# Altium project nuc977.PrjPcb
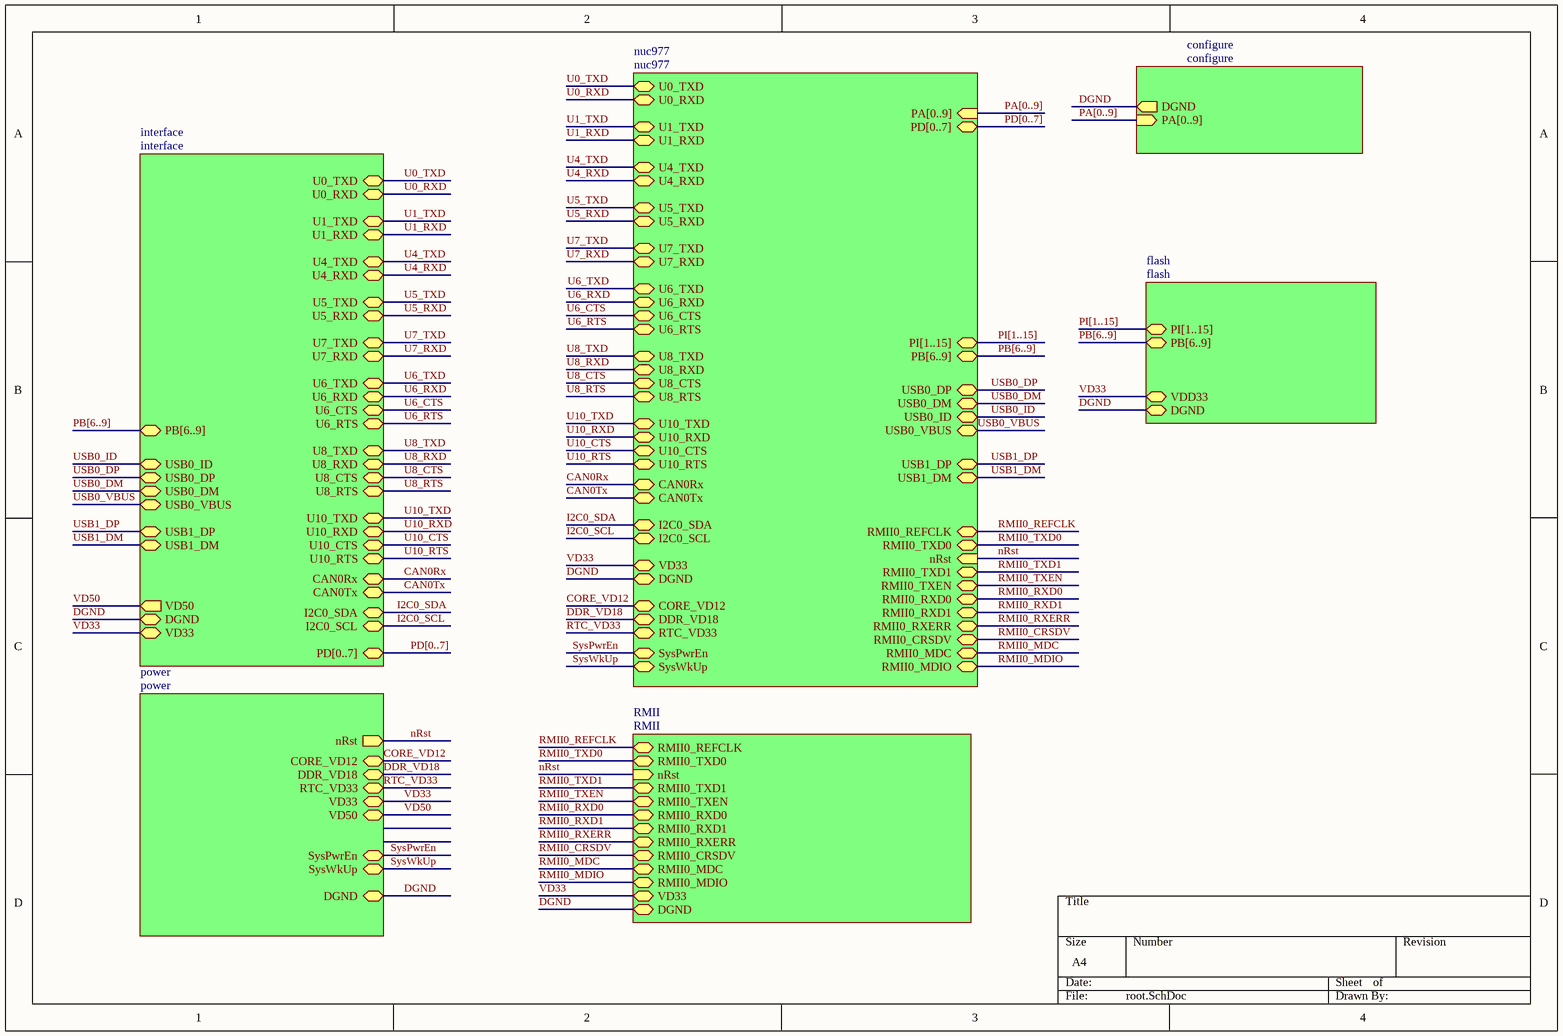
[diagram p0: root.SchDoc]
7 sheets, 234 parts. Net scope: hierarchical (ports join the sheet entries above them; power ports are global).
Board file: simple.PcbDoc
Sheets:
  root.SchDoc
    nuc977 = nuc977.SchDoc
    power = power.SchDoc
    flash = flash.SchDoc
    interface = interface.SchDoc
    configure = configure.SchDoc
    RMII = RMII.SchDoc

## Sheet root.SchDoc
size A4

### Sub-sheets
configure = configure: PA[0..9] (in), DGND (out)
flash = flash: DGND, VDD33, PI[1..15], PB[6..9]
interface = interface: U0_RXD, U0_TXD, U1_TXD, U1_RXD, U4_RXD, U4_TXD, U5_TXD, U5_RXD, U7_TXD, U7_RXD, U6_TXD, U6_RXD, U6_CTS, U6_RTS, U8_TXD, U8_RXD, U8_CTS, U8_RTS, U10_TXD, U10_RXD, U10_CTS, U10_RTS, CAN0Rx, CAN0Tx, I2C0_SDA, I2C0_SCL, DGND, VD33, USB0_DP, USB0_DM, USB0_ID, USB1_DP, USB1_DM, USB0_VBUS, VD50 (out), PD[0..7], PB[6..9]
nuc977 = nuc977: CORE_VD12, RTC_VD33, DDR_VD18, SysPwrEn (bidir), SysWkUp (bidir), VD33, DGND, U0_RXD, U0_TXD, U1_TXD, U1_RXD, U4_RXD, U4_TXD, U5_TXD, U5_RXD, U7_TXD, U7_RXD, U6_TXD, U6_RXD, U6_CTS, U6_RTS, U8_TXD, U8_RXD, U8_CTS, U8_RTS, U10_TXD, U10_RXD, U10_CTS, U10_RTS, CAN0Rx, CAN0Tx, I2C0_SDA, I2C0_SCL, USB0_DP, USB0_DM, PI[1..15], PB[6..9], RMII0_REFCLK, RMII0_TXD0, nRst (in), RMII0_TXD1, RMII0_TXEN, RMII0_RXD0, RMII0_RXD1, RMII0_RXERR, RMII0_CRSDV, RMII0_MDC, RMII0_MDIO, PA[0..9] (in), PD[0..7], USB0_ID, USB1_DP, USB1_DM, USB0_VBUS
power = power: CORE_VD12, RTC_VD33, DDR_VD18, SysPwrEn (bidir), SysWkUp (bidir), VD33, DGND, VD50, nRst (out)
RMII = RMII: RMII0_REFCLK, RMII0_TXD0, nRst (in), RMII0_TXD1, RMII0_TXEN, RMII0_RXD0, RMII0_RXD1, RMII0_RXERR, RMII0_CRSDV, RMII0_MDC, RMII0_MDIO, VD33, DGND

### Nets
CORE_VD12: sheet nuc977/CORE_VD12, sheet power/CORE_VD12
DDR_VD18: sheet nuc977/DDR_VD18, sheet power/DDR_VD18
DGND: sheet nuc977/DGND, sheet power/DGND, sheet flash/DGND, sheet interface/DGND, sheet configure/DGND, sheet RMII/DGND
RTC_VD33: sheet nuc977/RTC_VD33, sheet power/RTC_VD33
VD33: sheet nuc977/VD33, sheet power/VD33, sheet flash/VDD33, sheet interface/VD33, sheet RMII/VD33  [project net IO_VD33]
VD50: sheet power/VD50, sheet interface/VD50
CAN0Rx: sheet nuc977/CAN0Rx, sheet interface/CAN0Rx
CAN0Tx: sheet nuc977/CAN0Tx, sheet interface/CAN0Tx
I2C0_SCL: sheet nuc977/I2C0_SCL, sheet interface/I2C0_SCL
I2C0_SDA: sheet nuc977/I2C0_SDA, sheet interface/I2C0_SDA
nRst: sheet nuc977/nRst, sheet power/nRst, sheet RMII/nRst
RMII0_CRSDV: sheet nuc977/RMII0_CRSDV, sheet RMII/RMII0_CRSDV  [project net CRS_DV]
RMII0_MDC: sheet nuc977/RMII0_MDC, sheet RMII/RMII0_MDC  [project net PF0]
RMII0_MDIO: sheet nuc977/RMII0_MDIO, sheet RMII/RMII0_MDIO  [project net PF1]
RMII0_REFCLK: sheet nuc977/RMII0_REFCLK, sheet RMII/RMII0_REFCLK  [project net PF5]
RMII0_RXD0: sheet nuc977/RMII0_RXD0, sheet RMII/RMII0_RXD0  [project net PF6]
RMII0_RXD1: sheet nuc977/RMII0_RXD1, sheet RMII/RMII0_RXD1  [project net PF7]
RMII0_RXERR: sheet nuc977/RMII0_RXERR, sheet RMII/RMII0_RXERR  [project net FXEN]
RMII0_TXD0: sheet nuc977/RMII0_TXD0, sheet RMII/RMII0_TXD0  [project net PF2]
RMII0_TXD1: sheet nuc977/RMII0_TXD1, sheet RMII/RMII0_TXD1  [project net PF3]
RMII0_TXEN: sheet nuc977/RMII0_TXEN, sheet RMII/RMII0_TXEN  [project net PF4]
SysPwrEn: sheet nuc977/SysPwrEn, sheet power/SysPwrEn
SysWkUp: sheet nuc977/SysWkUp, sheet power/SysWkUp
U0_RXD: sheet nuc977/U0_RXD, sheet interface/U0_RXD  [project net PE1]
U0_TXD: sheet nuc977/U0_TXD, sheet interface/U0_TXD  [project net PE0]
U1_RXD: sheet nuc977/U1_RXD, sheet interface/U1_RXD
U1_TXD: sheet nuc977/U1_TXD, sheet interface/U1_TXD
U4_RXD: sheet nuc977/U4_RXD, sheet interface/U4_RXD
U4_TXD: sheet nuc977/U4_TXD, sheet interface/U4_TXD
U5_RXD: sheet nuc977/U5_RXD, sheet interface/U5_RXD  [project net PB1]
U5_TXD: sheet nuc977/U5_TXD, sheet interface/U5_TXD  [project net PB0]
U6_CTS: sheet nuc977/U6_CTS, sheet interface/U6_CTS  [project net PB5]
U6_RTS: sheet nuc977/U6_RTS, sheet interface/U6_RTS  [project net PB4]
U6_RXD: sheet nuc977/U6_RXD, sheet interface/U6_RXD  [project net PB3]
U6_TXD: sheet nuc977/U6_TXD, sheet interface/U6_TXD  [project net PB2]
U7_RXD: sheet nuc977/U7_RXD, sheet interface/U7_RXD
U7_TXD: sheet nuc977/U7_TXD, sheet interface/U7_TXD
U8_CTS: sheet nuc977/U8_CTS, sheet interface/U8_CTS
U8_RTS: sheet nuc977/U8_RTS, sheet interface/U8_RTS
U8_RXD: sheet nuc977/U8_RXD, sheet interface/U8_RXD
U8_TXD: sheet nuc977/U8_TXD, sheet interface/U8_TXD
U10_CTS: sheet nuc977/U10_CTS, sheet interface/U10_CTS  [project net PB15]
U10_RTS: sheet nuc977/U10_RTS, sheet interface/U10_RTS  [project net PB14]
U10_RXD: sheet nuc977/U10_RXD, sheet interface/U10_RXD  [project net PB13]
U10_TXD: sheet nuc977/U10_TXD, sheet interface/U10_TXD  [project net PB12]
USB0_DM: sheet nuc977/USB0_DM, sheet interface/USB0_DM
USB0_DP: sheet nuc977/USB0_DP, sheet interface/USB0_DP
USB0_ID: sheet nuc977/USB0_ID, sheet interface/USB0_ID
USB0_VBUS: sheet nuc977/USB0_VBUS, sheet interface/USB0_VBUS  [project net PH0]
USB1_DM: sheet nuc977/USB1_DM, sheet interface/USB1_DM
USB1_DP: sheet nuc977/USB1_DP, sheet interface/USB1_DP

### Buses and harness runs
bus PA[0..9] = sheet configure/PA[0..9]
bus PA[0..9] = sheet nuc977/PA[0..9]
bus PB[6..9] = sheet flash/PB[6..9]
bus PB[6..9] = sheet interface/PB[6..9]
bus PB[6..9] = sheet nuc977/PB[6..9]
bus PD[0..7] = sheet interface/PD[0..7]
bus PD[0..7] = sheet nuc977/PD[0..7]
bus PI[1..15] = sheet flash/PI[1..15]
bus PI[1..15] = sheet nuc977/PI[1..15]

## Sheet nuc977.SchDoc
size A3
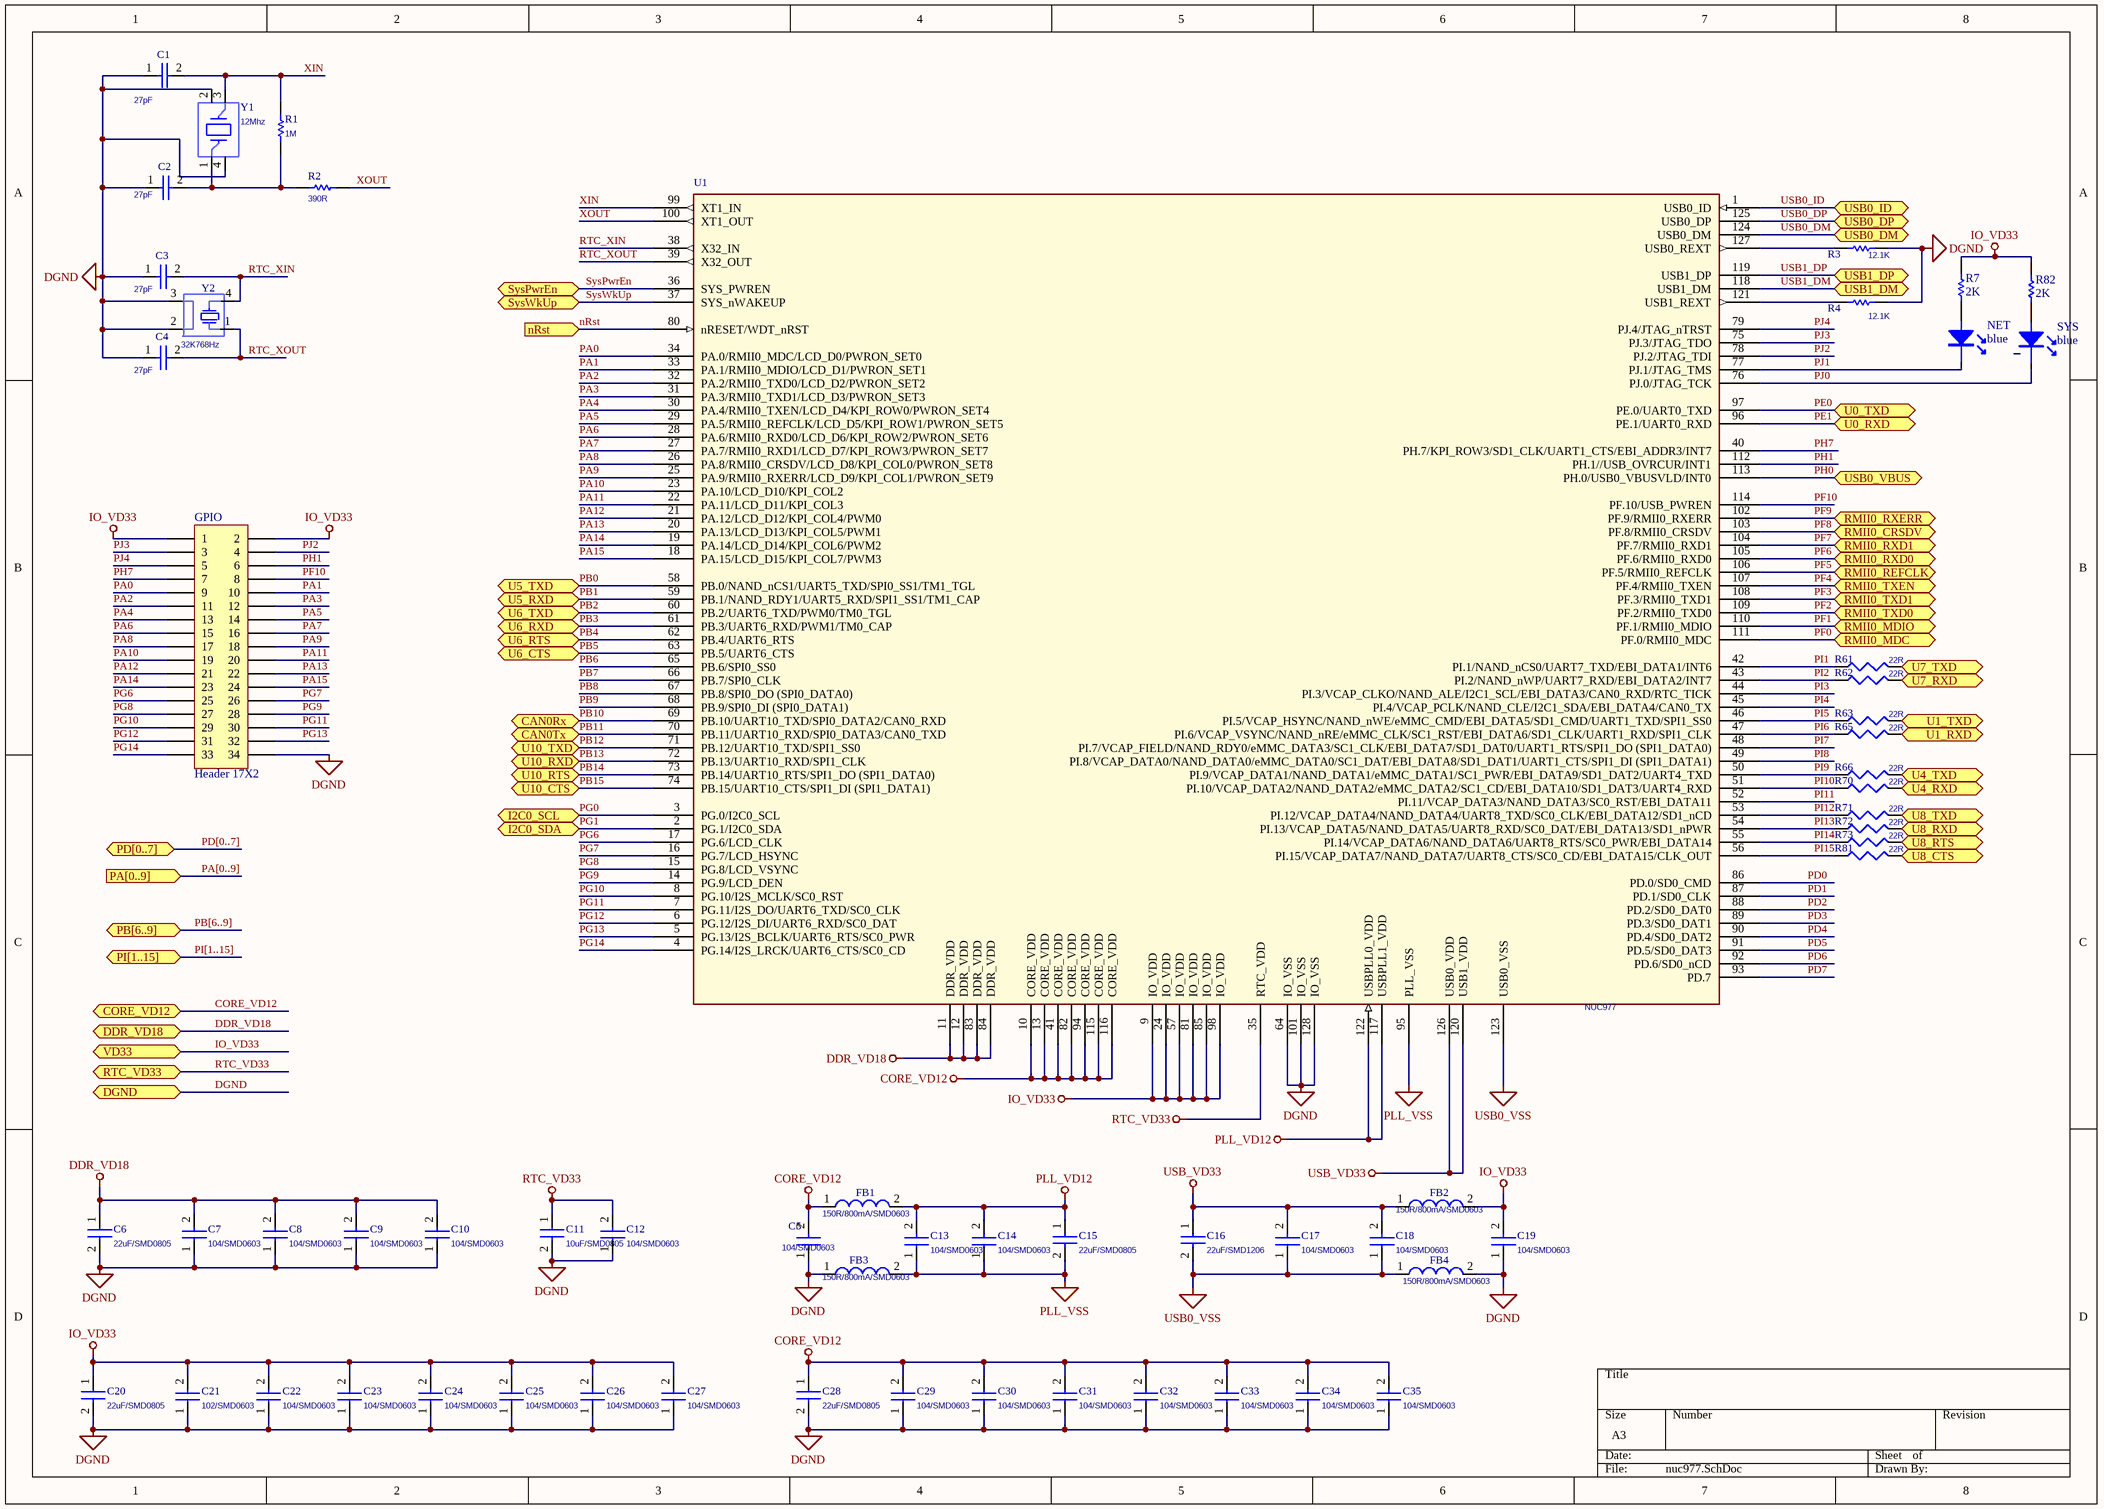
[diagram p1: nuc977.SchDoc]

### Parts
C1  27pF  [0603C]
C2  27pF  [0603C]
C3  27pF  [0603C]
C4  27pF  [0603C]
C5  104/SMD0603  [0603C]
C6  22uF/SMD0805  [C0805]
C7  104/SMD0603  [0603C]
C8  104/SMD0603  [0603C]
C9  104/SMD0603  [0603C]
C10  104/SMD0603  [0603C]
C11  10uF/SMD0805  [C0805]
C12  104/SMD0603  [0603C]
C13  104/SMD0603  [0603C]
C14  104/SMD0603  [0603C]
C15  22uF/SMD0805  [C0805]
C16  22uF/SMD1206  [C0805]
C17  104/SMD0603  [0603C]
C18  104/SMD0603  [0603C]
C19  104/SMD0603  [0603C]
C20  22uF/SMD0805  [C0805]
C21  102/SMD0603  [0603C]
C22  104/SMD0603  [0603C]
C23  104/SMD0603  [0603C]
C24  104/SMD0603  [0603C]
C25  104/SMD0603  [0603C]
C26  104/SMD0603  [0603C]
C27  104/SMD0603  [0603C]
C28  22uF/SMD0805  [C0805]
C29  104/SMD0603  [0603C]
C30  104/SMD0603  [0603C]
C31  104/SMD0603  [0603C]
C32  104/SMD0603  [0603C]
C33  104/SMD0603  [0603C]
C34  104/SMD0603  [0603C]
C35  104/SMD0603  [0603C]
FB1  150R/800mA/SMD0603  [0603R]
FB2  150R/800mA/SMD0603  [0603R]
FB3  150R/800mA/SMD0603  [0603R]
FB4  150R/800mA/SMD0603  [0603R]
GPIO  Header 17X2  [HDR2X17]
NET  blue  [LED-0603]
R1  1M  [0603R]
R2  390R  [0603R]
R3  12.1K  [0603R]
R4  12.1K  [0603R]
R7  2K  [0603C]
R61  22R  [0603R]
R62  22R  [0603R]
R63  22R  [0603R]
R65  22R  [0603R]
R66  22R  [0603R]
R70  22R  [0603R]
R71  22R  [0603R]
R72  22R  [0603R]
R73  22R  [0603R]
R81  22R  [0603R]
R82  2K  [0603C]
SYS  blue  [LED-0603]
U1  NUC977  [QFP128/16/0.4]
Y1  12Mhz  [HCX-3SB3225]
Y2  32K768Hz  [32K768Hz]

### Ports
CAN0Rx, CAN0Tx, CORE_VD12, DDR_VD18, DGND, I2C0_SCL, I2C0_SDA, nRst (in), PA[0..9] (in), PB[6..9], PD[0..7], PI[1..15], RMII0_CRSDV, RMII0_MDC, RMII0_MDIO, RMII0_REFCLK, RMII0_RXD0, RMII0_RXD1, RMII0_RXERR, RMII0_TXD0, RMII0_TXD1, RMII0_TXEN, RTC_VD33, SysPwrEn (bidir), SysWkUp (bidir), U0_RXD, U0_TXD, U1_RXD, U1_TXD, U4_RXD, U4_TXD, U5_RXD, U5_TXD, U6_CTS, U6_RTS, U6_RXD, U6_TXD, U7_RXD, U7_TXD, U8_CTS, U8_RTS, U8_RXD, U8_TXD, U10_CTS, U10_RTS, U10_RXD, U10_TXD, USB0_DM, USB0_DP, USB0_ID, USB0_VBUS, USB1_DM, USB1_DP, VD33

### Nets
CORE_VD12: C5.2 C28.1 C29.2 C30.2 C31.2 C32.2 C33.2 C34.2 C35.2 FB1.1 U1.10(CORE_VDD) U1.13(CORE_VDD) U1.41(CORE_VDD) U1.82(CORE_VDD) U1.94(CORE_VDD) U1.115(CORE_VDD) U1.116(CORE_VDD) ; port CORE_VD12
DDR_VD18: C6.1 C7.2 C8.2 C9.2 C10.2 U1.11(DDR_VDD) U1.12(DDR_VDD) U1.83(DDR_VDD) U1.84(DDR_VDD) ; port DDR_VD18
DGND: C1.1 C2.1 C3.1 C4.1 C5.1 C6.2 C7.1 C8.1 C9.1 C10.1 C11.2 C12.1 C19.1 C20.2 C21.1 C22.1 C23.1 C24.1 C25.1 C26.1 C27.1 C28.2 C29.1 C30.1 C31.1 C32.1 C33.1 C34.1 C35.1 FB3.1 FB4.2 GPIO.34 R3.2 R4.2 U1.64(IO_VSS) U1.101(IO_VSS) U1.128(IO_VSS) Y1.2 Y1.4 Y2.2 Y2.3 ; port DGND
IO_VD33: C19.2 C20.1 C21.2 C22.2 C23.2 C24.2 C25.2 C26.2 C27.2 FB2.2 GPIO.1 GPIO.2 R7.2 R82.2 U1.9(IO_VDD) U1.24(IO_VDD) U1.57(IO_VDD) U1.81(IO_VDD) U1.85(IO_VDD) U1.98(IO_VDD) ; port VD33
PLL_VD12: C13.2 C14.2 C15.1 FB1.2 U1.117(USBPLL1_VDD) U1.122(USBPLL0_VDD)
PLL_VSS: C13.1 C14.1 C15.2 FB3.2 U1.95(PLL_VSS)
RTC_VD33: C11.1 C12.2 U1.35(RTC_VDD) ; port RTC_VD33
USB0_VSS: C16.2 C17.1 C18.1 FB4.1 U1.123(USB0_VSS)
USB_VD33: C16.1 C17.2 C18.2 FB2.1 U1.120(USB1_VDD) U1.126(USB0_VDD)
nRst: U1.80(nRESET/WDT_nRST) ; port nRst
PA0: GPIO.9 U1.34(PA.0/RMII0_MDC/LCD_D0/PWRON_SET0)
PA1: GPIO.10 U1.33(PA.1/RMII0_MDIO/LCD_D1/PWRON_SET1)
PA2: GPIO.11 U1.32(PA.2/RMII0_TXD0/LCD_D2/PWRON_SET2)
PA3: GPIO.12 U1.31(PA.3/RMII0_TXD1/LCD_D3/PWRON_SET3)
PA4: GPIO.13 U1.30(PA.4/RMII0_TXEN/LCD_D4/KPI_ROW0/PWRON_SET4)
PA5: GPIO.14 U1.29(PA.5/RMII0_REFCLK/LCD_D5/KPI_ROW1/PWRON_SET5)
PA6: GPIO.15 U1.28(PA.6/RMII0_RXD0/LCD_D6/KPI_ROW2/PWRON_SET6)
PA7: GPIO.16 U1.27(PA.7/RMII0_RXD1/LCD_D7/KPI_ROW3/PWRON_SET7)
PA8: GPIO.17 U1.26(PA.8/RMII0_CRSDV/LCD_D8/KPI_COL0/PWRON_SET8)
PA9: GPIO.18 U1.25(PA.9/RMII0_RXERR/LCD_D9/KPI_COL1/PWRON_SET9)
PA10: GPIO.19 U1.23(PA.10/LCD_D10/KPI_COL2)
PA11: GPIO.20 U1.22(PA.11/LCD_D11/KPI_COL3)
PA12: GPIO.21 U1.21(PA.12/LCD_D12/KPI_COL4/PWM0)
PA13: GPIO.22 U1.20(PA.13/LCD_D13/KPI_COL5/PWM1)
PA14: GPIO.23 U1.19(PA.14/LCD_D14/KPI_COL6/PWM2)
PA15: GPIO.24 U1.18(PA.15/LCD_D15/KPI_COL7/PWM3)
PB0: U1.58(PB.0/NAND_nCS1/UART5_TXD/SPI0_SS1/TM1_TGL) ; port U5_TXD
PB1: U1.59(PB.1/NAND_RDY1/UART5_RXD/SPI1_SS1/TM1_CAP) ; port U5_RXD
PB2: U1.60(PB.2/UART6_TXD/PWM0/TM0_TGL) ; port U6_TXD
PB3: U1.61(PB.3/UART6_RXD/PWM1/TM0_CAP) ; port U6_RXD
PB4: U1.62(PB.4/UART6_RTS) ; port U6_RTS
PB5: U1.63(PB.5/UART6_CTS) ; port U6_CTS
PB6: U1.65(PB.6/SPI0_SS0)
PB7: U1.66(PB.7/SPI0_CLK)
PB8: U1.67(PB.8/SPI0_DO_(SPI0_DATA0))
PB9: U1.68(PB.9/SPI0_DI_(SPI0_DATA1))
PB10: U1.69(PB.10/UART10_TXD/SPI0_DATA2/CAN0_RXD) ; port CAN0Rx  [project net CAN0Rx]
PB11: U1.70(PB.11/UART10_RXD/SPI0_DATA3/CAN0_TXD) ; port CAN0Tx  [project net CAN0Tx]
PB12: U1.71(PB.12/UART10_TXD/SPI1_SS0) ; port U10_TXD
PB13: U1.72(PB.13/UART10_RXD/SPI1_CLK) ; port U10_RXD
PB14: U1.73(PB.14/UART10_RTS/SPI1_DO_(SPI1_DATA0)) ; port U10_RTS
PB15: U1.74(PB.15/UART10_CTS/SPI1_DI_(SPI1_DATA1)) ; port U10_CTS
PD0: U1.86(PD.0/SD0_CMD)
PD1: U1.87(PD.1/SD0_CLK)
PD2: U1.88(PD.2/SD0_DAT0)
PD3: U1.89(PD.3/SD0_DAT1)
PD4: U1.90(PD.4/SD0_DAT2)
PD5: U1.91(PD.5/SD0_DAT3)
PD6: U1.92(PD.6/SD0_nCD)
PD7: U1.93(PD.7)
PE0: U1.97(PE.0/UART0_TXD) ; port U0_TXD
PE1: U1.96(PE.1/UART0_RXD) ; port U0_RXD
PF0: U1.111(PF.0/RMII0_MDC) ; port RMII0_MDC
PF1: U1.110(PF.1/RMII0_MDIO) ; port RMII0_MDIO
PF2: U1.109(PF.2/RMII0_TXD0) ; port RMII0_TXD0
PF3: U1.108(PF.3/RMII0_TXD1) ; port RMII0_TXD1
PF4: U1.107(PF.4/RMII0_TXEN) ; port RMII0_TXEN
PF5: U1.106(PF.5/RMII0_REFCLK) ; port RMII0_REFCLK
PF6: U1.105(PF.6/RMII0_RXD0) ; port RMII0_RXD0
PF7: U1.104(PF.7/RMII0_RXD1) ; port RMII0_RXD1
PF8: U1.103(PF.8/RMII0_CRSDV) ; port RMII0_CRSDV  [project net CRS_DV]
PF9: U1.102(PF.9/RMII0_RXERR) ; port RMII0_RXERR  [project net FXEN]
PF10: GPIO.8 U1.114(PF.10/USB_PWREN)
PG0: U1.3(PG.0/I2C0_SCL) ; port I2C0_SCL  [project net I2C0_SCL]
PG1: U1.2(PG.1/I2C0_SDA) ; port I2C0_SDA  [project net I2C0_SDA]
PG6: GPIO.25 U1.17(PG.6/LCD_CLK)
PG7: GPIO.26 U1.16(PG.7/LCD_HSYNC)
PG8: GPIO.27 U1.15(PG.8/LCD_VSYNC)
PG9: GPIO.28 U1.14(PG.9/LCD_DEN)
PG10: GPIO.29 U1.8(PG.10/I2S_MCLK/SC0_RST)
PG11: GPIO.30 U1.7(PG.11/I2S_DO/UART6_TXD/SC0_CLK)
PG12: GPIO.31 U1.6(PG.12/I2S_DI/UART6_RXD/SC0_DAT)
PG13: GPIO.32 U1.5(PG.13/I2S_BCLK/UART6_RTS/SC0_PWR)
PG14: GPIO.33 U1.4(PG.14/I2S_LRCK/UART6_CTS/SC0_CD)
PH0: U1.113(PH.0/USB0_VBUSVLD/INT0) ; port USB0_VBUS
PH1: GPIO.6 U1.112(PH.1//USB_OVRCUR/INT1)
PH7: GPIO.7 U1.40(PH.7/KPI_ROW3/SD1_CLK/UART1_CTS/EBI_ADDR3/INT7)
PI1: R61.1 U1.42(PI.1/NAND_nCS0/UART7_TXD/EBI_DATA1/INT6)  [project net NAND_nCS0]
PI2: R62.1 U1.43(PI.2/NAND_nWP/UART7_RXD/EBI_DATA2/INT7)  [project net NAND_nWP]
PI3: U1.44(PI.3/VCAP_CLKO/NAND_ALE/I2C1_SCL/EBI_DATA3/CAN0_RXD/RTC_TICK)  [project net NAND_ALE]
PI4: U1.45(PI.4/VCAP_PCLK/NAND_CLE/I2C1_SDA/EBI_DATA4/CAN0_TX)  [project net NAND_CLE]
PI5: R63.1 U1.46(PI.5/VCAP_HSYNC/NAND_nWE/eMMC_CMD/EBI_DATA5/SD1_CMD/UART1_TXD/SPI1_SS0)  [project net NAND_nWE]
PI6: R65.1 U1.47(PI.6/VCAP_VSYNC/NAND_nRE/eMMC_CLK/SC1_RST/EBI_DATA6/SD1_CLK/UART1_RXD/SPI1_CLK)  [project net NAND_nRE]
PI7: U1.48(PI.7/VCAP_FIELD/NAND_RDY0/eMMC_DATA3/SC1_CLK/EBI_DATA7/SD1_DAT0/UART1_RTS/SPI1_DO_(SPI1_DATA0))  [project net NAND_RDY0]
PI8: U1.49(PI.8/VCAP_DATA0/NAND_DATA0/eMMC_DATA0/SC1_DAT/EBI_DATA8/SD1_DAT1/UART1_CTS/SPI1_DI_(SPI1_DATA1))  [project net NAND_D0]
PI9: R66.1 U1.50(PI.9/VCAP_DATA1/NAND_DATA1/eMMC_DATA1/SC1_PWR/EBI_DATA9/SD1_DAT2/UART4_TXD)  [project net NAND_D1]
PI10: R70.1 U1.51(PI.10/VCAP_DATA2/NAND_DATA2/eMMC_DATA2/SC1_CD/EBI_DATA10/SD1_DAT3/UART4_RXD)  [project net NAND_D2]
PI11: U1.52(PI.11/VCAP_DATA3/NAND_DATA3/SC0_RST/EBI_DATA11)  [project net NAND_D3]
PI12: R71.1 U1.53(PI.12/VCAP_DATA4/NAND_DATA4/UART8_TXD/SC0_CLK/EBI_DATA12/SD1_nCD)  [project net NAND_D4]
PI13: R72.1 U1.54(PI.13/VCAP_DATA5/NAND_DATA5/UART8_RXD/SC0_DAT/EBI_DATA13/SD1_nPWR)  [project net NAND_D5]
PI14: R73.1 U1.55(PI.14/VCAP_DATA6/NAND_DATA6/UART8_RTS/SC0_PWR/EBI_DATA14)  [project net NAND_D6]
PI15: R81.1 U1.56(PI.15/VCAP_DATA7/NAND_DATA7/UART8_CTS/SC0_CD/EBI_DATA15/CLK_OUT)  [project net NAND_D7]
PJ0: SYS.2 U1.76(PJ.0/JTAG_TCK)
PJ1: NET.2 U1.77(PJ.1/JTAG_TMS)
PJ2: GPIO.4 U1.78(PJ.2/JTAG_TDI)
PJ3: GPIO.3 U1.75(PJ.3/JTAG_TDO)
PJ4: GPIO.5 U1.79(PJ.4/JTAG_nTRST)
RTC_XIN: C3.2 U1.38(X32_IN) Y2.4
RTC_XOUT: C4.2 U1.39(X32_OUT) Y2.1
SysPwrEn: U1.36(SYS_PWREN) ; port SysPwrEn
SysWkUp: U1.37(SYS_nWAKEUP) ; port SysWkUp
U1_RXD: R65.2 ; port U1_RXD
U1_TXD: R63.2 ; port U1_TXD
U4_RXD: R70.2 ; port U4_RXD
U4_TXD: R66.2 ; port U4_TXD
U7_RXD: R62.2 ; port U7_RXD
U7_TXD: R61.2 ; port U7_TXD
U8_CTS: R81.2 ; port U8_CTS
U8_RTS: R73.2 ; port U8_RTS
U8_RXD: R72.2 ; port U8_RXD
U8_TXD: R71.2 ; port U8_TXD
USB0_DM: U1.124(USB0_DM) ; port USB0_DM
USB0_DP: U1.125(USB0_DP) ; port USB0_DP
USB0_ID: U1.1(USB0_ID) ; port USB0_ID
USB1_DM: U1.118(USB1_DM) ; port USB1_DM
USB1_DP: U1.119(USB1_DP) ; port USB1_DP
XIN: C1.2 R1.1 U1.99(XT1_IN) Y1.3
XOUT: R2.2 U1.100(XT1_OUT)
NetC2_2: C2.2 R1.2 R2.1 Y1.1
NetNET_1: NET.1 R7.1
NetR3_1: R3.1 U1.127(USB0_REXT)
NetR4_1: R4.1 U1.121(USB1_REXT)
NetR82_1: R82.1 SYS.1

### Buses and harness runs
bus PA[0..9] = port PA[0..9]
bus PB[6..9] = port PB[6..9]
bus PD[0..7] = port PD[0..7]
bus PI[1..15] = port PI[1..15]

### Library data of the parts
C1-C4 = CAP: Capacitor
C5 C7-C10 C12-C14 C17-C19 C21-C27 C29-C35 = C/SMD0603
C6 C15 C16 C20 C28 = C/SMD1206
C11 = C/SMD0805
FB1-FB4 = FB/SMD0603
GPIO = Header 17X2: Header, 17-Pin, Dual row; LatestRevisionDate: 17-Jul-2002; LatestRevisionNote: Re-released for DXP Platform.; Publisher: Altium Limited
NET SYS = LED
R1-R4 R7 R82 = res1: Resistor; Value: 1K; Published: 8-Jun-2000; Revision: July-2002: Re-released for DXP Platform.; Publisher: Altium Limited
R61-R63 R65 R66 R70-R73 R81 = R_Dup1
U1 = NUC977_7

## Sheet power.SchDoc
size A3
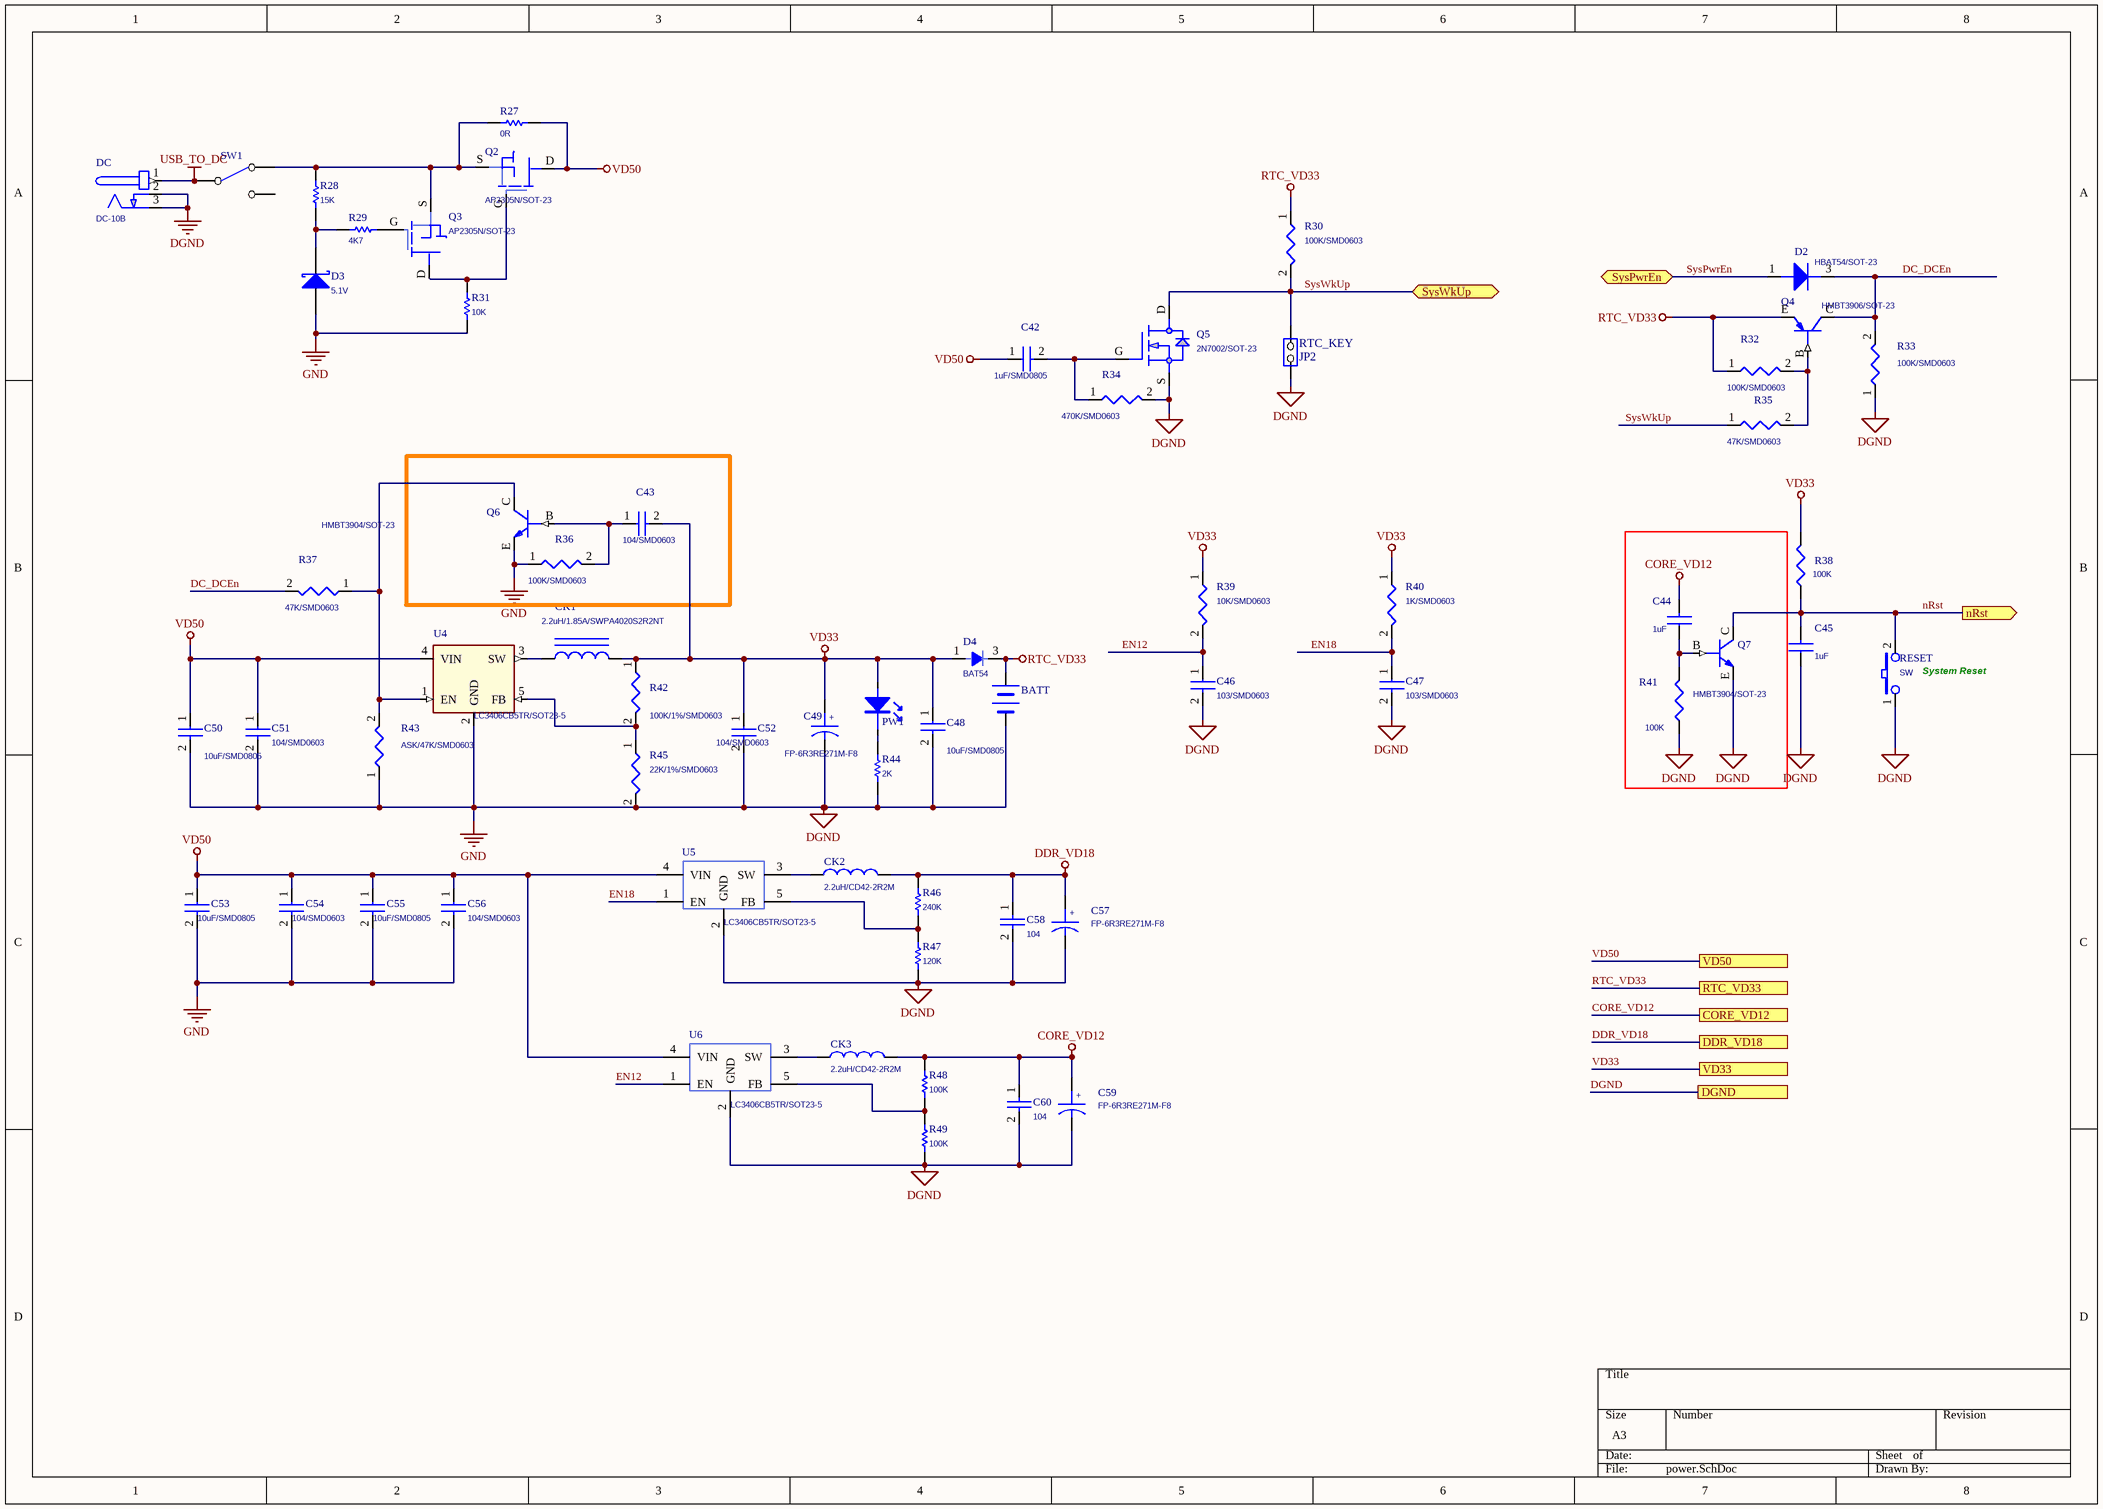
[diagram p2: power.SchDoc]

### Parts
BATT  BATTERY  [MS621]  (value not drawn)
C42  1uF/SMD0805  [C0805]
C43  104/SMD0603  [0603C]
C44  1uF  [0603C]
C45  1uF  [0603C]
C46  103/SMD0603  [0603C]
C47  103/SMD0603  [0603C]
C48  10uF/SMD0805  [C0805]
C49  FP-6R3RE271M-F8  [6R3RE271M]
C50  10uF/SMD0805  [C0805]
C51  104/SMD0603  [0603C]
C52  104/SMD0603  [0603C]
C53  10uF/SMD0805  [C0805]
C54  104/SMD0603  [0603C]
C55  10uF/SMD0805  [C0805]
C56  104/SMD0603  [0603C]
C57  FP-6R3RE271M-F8  [6R3RE271M]
C58  104  [0603C]
C59  FP-6R3RE271M-F8  [6R3RE271M]
C60  104  [0603C]
CK1  2.2uH/1.85A/SWPA4020S2R2NT  [C1210_M]
CK2  2.2uH/CD42-2R2M  [C1210_M]
CK3  2.2uH/CD42-2R2M  [C1210_M]
D2  HBAT54/SOT-23  [SOT-23_HBAT54]
D3  5.1V  [SOD-123_1N5819HW]
D4  BAT54  [BAT54]
DC  DC-10B  [DC-JACK]
PW1  red  [LED-0603]  (value not drawn)
Q2  AP2305N/SOT-23  [AP2305N_SOT23]
Q3  AP2305N/SOT-23  [AP2305N_SOT23]
Q4  HMBT3906/SOT-23  [SOT-23_HMBT3906]
Q5  2N7002/SOT-23  [SOT-23_H2N7002]
Q6  HMBT3904/SOT-23  [SOT-23_HMBT3904]
Q7  HMBT3904/SOT-23  [SOT-23_HMBT3904]
R27  0R  [0603C]
R28  15K  [0603C]
R29  4K7  [0603C]
R30  100K/SMD0603  [0603R]
R31  10K  [0603C]
R32  100K/SMD0603  [0603R]
R33  100K/SMD0603  [0603R]
R34  470K/SMD0603  [0603R]
R35  47K/SMD0603  [0603R]
R36  100K/SMD0603  [0603R]
R37  47K/SMD0603  [0603R]
R38  100K  [0603R]
R39  10K/SMD0603  [0603R]
R40  1K/SMD0603  [0603R]
R41  100K  [0603R]
R42  100K/1%/SMD0603  [0603R]
R43  ASK/47K/SMD0603  [0603R]
R44  2K  [0603R]
R45  22K/1%/SMD0603  [0603R]
R46  240K  [0603R]
R47  120K  [0603R]
R48  100K  [0603R]
R49  100K  [0603R]
RESET  SW  [SW-PB2]
RTC_KEY  JP2  [mhdr1x2]
SW1  (no value)  [SS-12D07]
U4  LC3406CB5TR/SOT23-5  [SOT-23-5]
U5  LC3406CB5TR/SOT23-5  [SOT-23-5]
U6  LC3406CB5TR/SOT23-5  [SOT-23-5]

### Ports
CORE_VD12, DDR_VD18, DGND, nRst (out), RTC_VD33, SysPwrEn (bidir), SysWkUp (bidir), VD33, VD50

### Nets
CORE_VD12: C44.2 C59.1 C60.1 CK3.2 R48.2 ; port CORE_VD12
DDR_VD18: C57.1 C58.1 CK2.2 R46.2 ; port DDR_VD18
DGND: BATT.2 C45.1 C46.2 C47.2 C48.2 C49.2 C50.2 C51.2 C52.2 C53.2 C54.2 C55.2 C56.2 C57.2 C58.2 C59.2 C60.2 D3.2(A) DC.2(GND) DC.3(GND) Q5.S Q6.E(EMITTER) Q7.E(EMITTER) R31.1 R33.1 R34.2 R36.1 R41.2 R43.1 R44.1 R45.2 R47.1 R49.1 RESET.1 RTC_KEY.1(COMMON) U4.2(GND) U5.2(GND) U6.2(GND) ; port DGND  [also labelled GND]
RTC_VD33: BATT.1 D4.3 Q4.E(EMITTER) R30.1 R32.1 ; port RTC_VD33
USB_TO_DC: DC.1(+) SW1.1(COMMON)
VD33: C43.2 C48.1 C49.1 C52.1 CK1.2 D4.1 PW1.1 R38.1 R39.1 R40.1 R42.1 ; port VD33  [project net IO_VD33]
VD50: C42.1 C50.1 C51.1 C53.1 C54.1 C55.1 C56.1 Q2.D R27.1 U4.4(VIN) U5.4(VIN) U6.4(VIN) ; port VD50
DC_DCEn: D2.3 Q4.C(COLLECTOR) R33.2 R37.2
EN12: C46.1 R39.2 U6.1(EN)
EN18: C47.1 R40.2 U5.1(EN)
nRst: C45.2 Q7.C(COLLECTOR) R38.2 RESET.2 ; port nRst
SysPwrEn: D2.1 ; port SysPwrEn
SysWkUp: Q5.D R30.2 R35.1 RTC_KEY.2(NO) ; port SysWkUp
NetC42_2: C42.2 Q5.G R34.1
NetC43_1: C43.1 Q6.B(BASE) R36.2
NetC44_1: C44.1 Q7.B(BASE) R41.1
NetCK1_1: CK1.1 U4.3(SW)
NetCK2_1: CK2.1 U5.3(SW)
NetCK3_1: CK3.1 U6.3(SW)
NetD3_1: D3.1(K) R28.1 R29.2
NetPW1_2: PW1.2 R44.2
NetQ2_G: Q2.G Q3.D R31.2
NetQ2_S: Q2.S Q3.S R27.2 R28.2 SW1.2(NC)
NetQ3_G: Q3.G R29.1
NetQ4_B: Q4.B(BASE) R32.2 R35.2
NetQ6_C: Q6.C(COLLECTOR) R37.1 R43.2 U4.1(EN)
NetR42_2: R42.2 R45.1 U4.5(FB)
NetR46_1: R46.1 R47.2 U5.5(FB)
NetR48_1: R48.1 R49.2 U6.5(FB)

Not connected (* = marked no-connect by the designer): SW1 3(NO)

### Notes on the sheet
- (near RESET) System Reset
- (in symbol CAP POL) +

### Library data of the parts
C42 C48 C50 = C/SMD0805
C43 C46 C47 C51 C52 C54 C56 = C/SMD0603
C44 C45 = CAP NP_Dup1
C49 C57 C59 = CAP POL
C53 C55 = C/SMD1206
C58 C60 = CAP: Capacitor
CK1 = INDUCTOR IRON
CK2 CK3 = INDUCTOR1
D3 = Diode 10TQ035: Schottky Rectifier; Note: Terminal 2 is the TAB and is electrically connected to the cathode; Published: 8-Jun-2000; LatestRevisionDate: 17-Jul-2002; LatestRevisionNote: Re-released for DXP Platform.; DatasheetVersion: PD-2.057B; PackageVersion: Feb-1998; PackageReference: TO-220AC; Publisher: Altium Limited; PackageDescription: TO, Thru-Hole, Vertical, Heatsink Mounted; 3 In-Line Leads (1 Absent); Pitch 2.54 mm; ComponentLink1Description: Manufacturer Link; ComponentLink1URL: http://www.irf.com/; ComponentLink2Description: Datasheet; ComponentLink2URL: http://www.irf.com/product-info/datasheets/data/10tq.pdf
DC = PJ202A
PW1 = LED
Q5 = 2N7002/SOT-23_Dup1
R27-R29 R31 R44 R46-R49 = res1: Resistor; Value: 1K; Published: 8-Jun-2000; Revision: July-2002: Re-released for DXP Platform.; Publisher: Altium Limited
R30 R32-R37 R39 R40 R42 R43 R45 = R/SMD0603
R38 R41 = R_Dup1
RESET = SW_PUSH: Text Field1: 30; Text Field2: 30
SW1 = SW SPDT

## Sheet flash.SchDoc
size A4
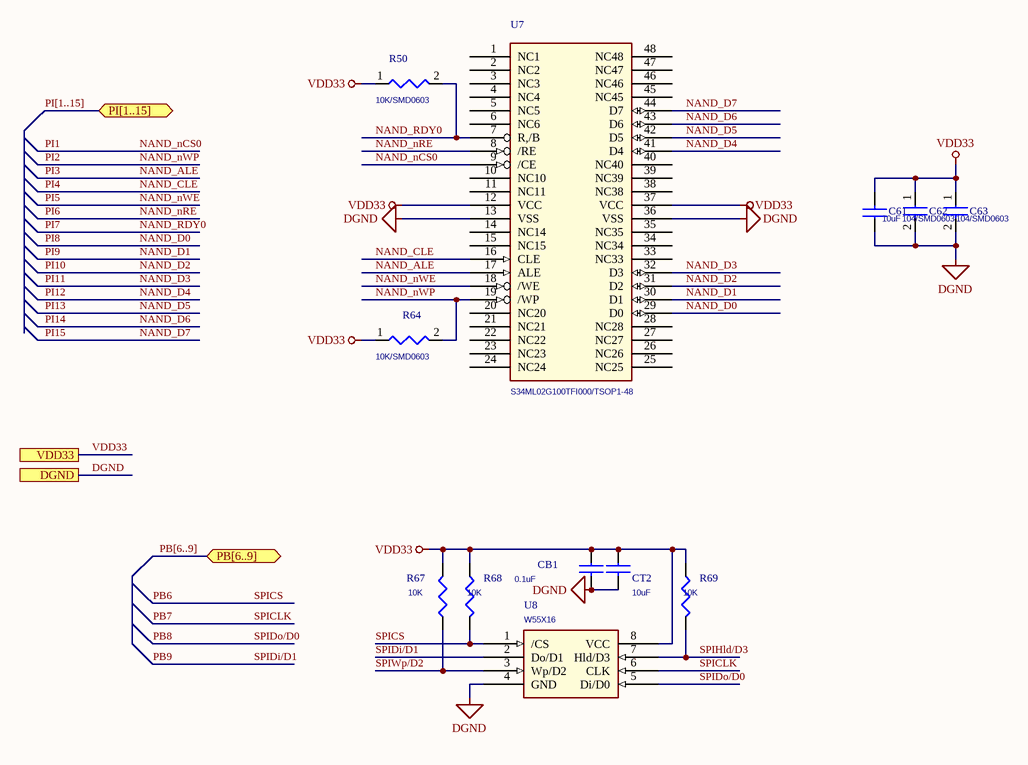
[diagram p3: flash.SchDoc]

### Parts
C61  10uF  [C0805]
C62  104/SMD0603  [0603C]
C63  104/SMD0603  [0603C]
CB1  0.1uF  [0603C]
CT2  10uF  [C0805]
R50  10K/SMD0603  [0603R]
R64  10K/SMD0603  [0603R]
R67  10K  [0603R]
R68  10K  [0603R]
R69  10K  [0603R]
U7  S34ML02G100TFI000/TSOP1-48  [TSOP48-0.5MM]
U8  W55X16  [VDFPN8]

### Ports
DGND, PB[6..9], PI[1..15], VDD33

### Nets
DGND: C61.1 C62.2 C63.2 CB1.2 CT2.2 U7.13(VSS) U7.36(VSS) U8.4(GND) ; port DGND
VDD33: C61.2 C62.1 C63.1 CB1.1 CT2.1 R50.1 R64.1 R67.2 R68.2 R69.2 U7.12(VCC) U7.37(VCC) U8.8(VCC) ; port VDD33  [project net IO_VD33]
NAND_ALE: U7.17(ALE)  [also labelled PI3]
NAND_CLE: U7.16(CLE)  [also labelled PI4]
NAND_D0: U7.29(D0)  [also labelled PI8]
NAND_D1: U7.30(D1)  [also labelled PI9]
NAND_D2: U7.31(D2)  [also labelled PI10]
NAND_D3: U7.32(D3)  [also labelled PI11]
NAND_D4: U7.41(D4)  [also labelled PI12]
NAND_D5: U7.42(D5)  [also labelled PI13]
NAND_D6: U7.43(D6)  [also labelled PI14]
NAND_D7: U7.44(D7)  [also labelled PI15]
NAND_nCS0: U7.9(/CE)  [also labelled PI1]
NAND_nRE: U7.8(/RE)  [also labelled PI6]
NAND_nWE: U7.18(/WE)  [also labelled PI5]
NAND_nWP: R64.2 U7.19(/WP)  [also labelled PI2]
NAND_RDY0: R50.2 U7.7(R,/B)  [also labelled PI7]
PB6: R68.1 U8.1(/CS)  [also labelled SPICS]
PB7: U8.6(CLK)  [also labelled SPICLK]
PB8: U8.5(Di/D0)  [also labelled SPIDo/D0]
PB9: U8.2(Do/D1)  [also labelled SPIDi/D1]
SPIHld/D3: R69.1 U8.7(Hld/D3)
SPIWp/D2: R67.1 U8.3(Wp/D2)

Not connected (* = marked no-connect by the designer): U7 1(NC1) 2(NC2) 3(NC3) 4(NC4) 5(NC5) 6(NC6) 10(NC10) 11(NC11) 14(NC14) 15(NC15) 20(NC20) 21(NC21) 22(NC22) 23(NC23) 24(NC24) 25(NC25) 26(NC26) 27(NC27) 28(NC28) 33(NC33) 34(NC34) 35(NC35) 38(NC38) 39(NC39) 40(NC40) 45(NC45) 46(NC46) 47(NC47) 48(NC48)

### Buses and harness runs
bus PB[6..9] = port PB[6..9]
bus PI[1..15] = port PI[1..15]

### Library data of the parts
C61 CB1 CT2 = CAP NP_Dup1
C62 C63 = C/SMD0603
R50 R64 = R/SMD0603
R67-R69 = R_Dup1
U8 = W55X10_2

## Sheet interface.SchDoc
size A3
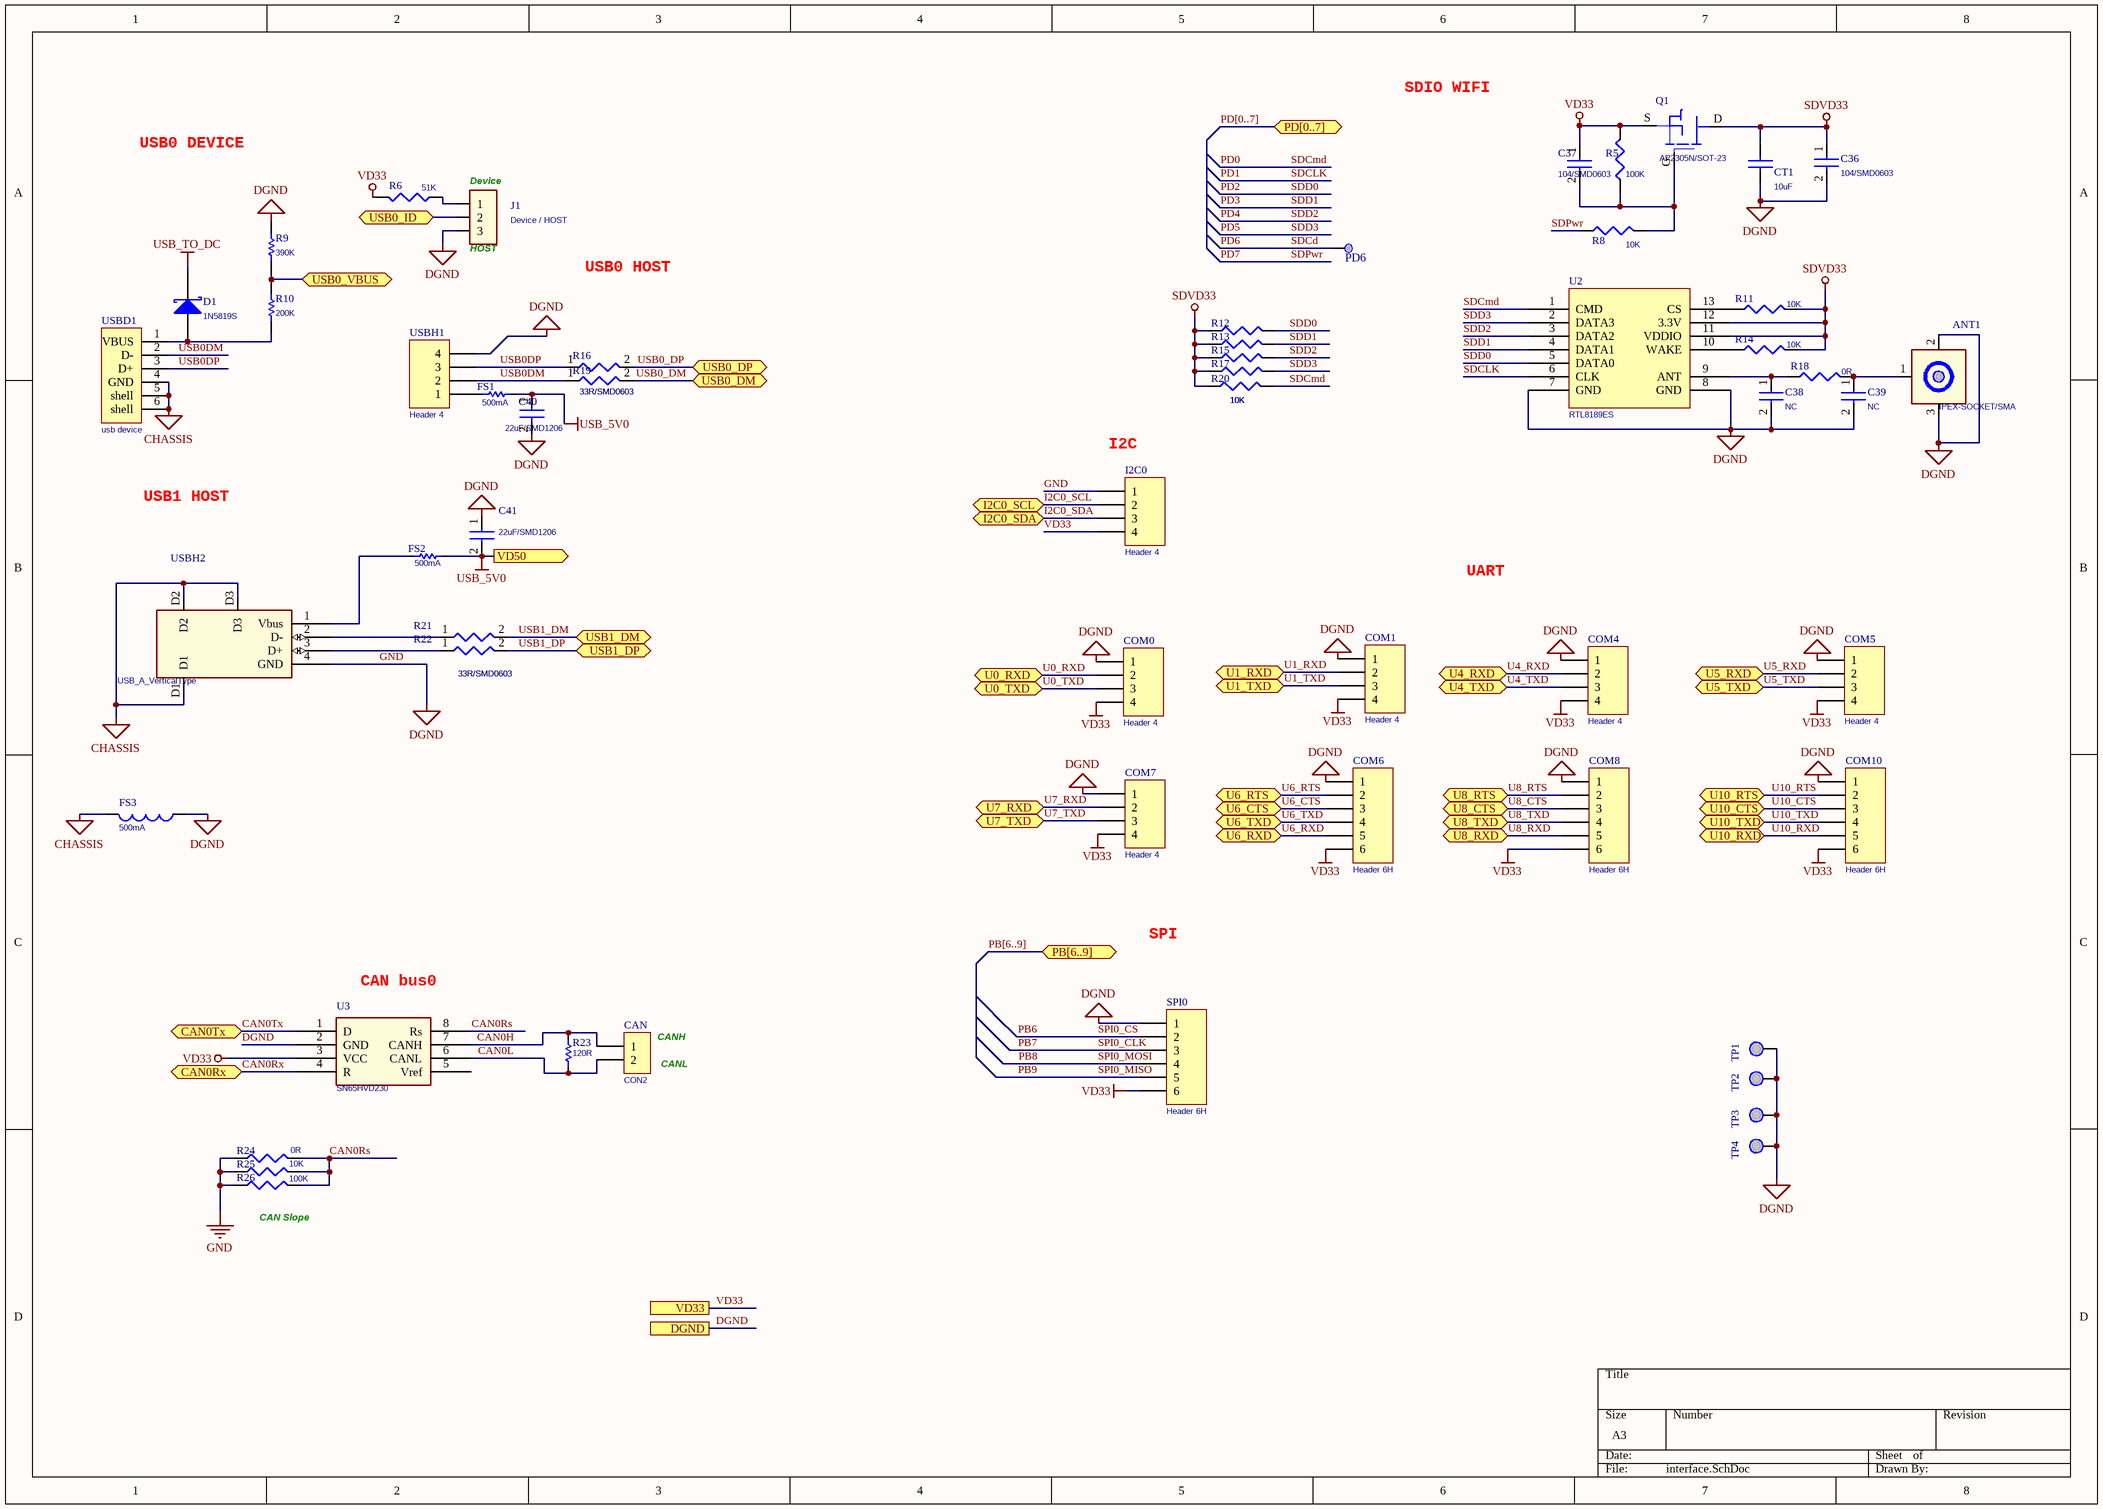
[diagram p4: interface.SchDoc]

### Parts
ANT1  IPEX-SOCKET/SMA  [ANT_PIX]
C36  104/SMD0603  [0603C]
C37  104/SMD0603  [0603C]
C38  NC  [0603C]
C39  NC  [0603C]
C40  22uF/SMD1206  [C0805]
C41  22uF/SMD1206  [C0805]
CAN  CON2  [INTERFACE-2]
COM0  Header 4  [PH04S_180]
COM1  Header 4  [PH04S_180]
COM4  Header 4  [PH04S_180]
COM5  Header 4  [PH04S_180]
COM6  Header 6H  [PH06S]
COM7  Header 4  [PH04S_180]
COM8  Header 6H  [PH06S]
COM10  Header 6H  [PH06S]
CT1  10uF  [C0805]
D1  1N5819S  [SOD-123_1N5819HW]
FS1  500mA  [0805]
FS2  500mA  [0805]
FS3  500mA  [0805R]
I2C0  Header 4  [PH04S_180]
J1  Device / HOST  [SIP3]
PD6  TP  [TP]  (value not drawn)
Q1  AP2305N/SOT-23  [AP2305N_SOT23]
R5  100K  [0603R]
R6  51K  [0603R]
R8  10K  [0603R]
R9  390K  [0603R]
R10  200K  [0603R]
R11  10K  [0603R]
R12  10K  [0603R]
R13  10K  [0603R]
R14  10K  [0603R]
R15  10K  [0603R]
R16  33R/SMD0603  [0603R]
R17  10K  [0603R]
R18  0R  [0603R]
R19  33R/SMD0603  [0603R]
R20  10K  [0603R]
R21  33R/SMD0603  [0603R]
R22  33R/SMD0603  [0603R]
R23  120R  [0805]
R24  0R  [0603R]
R25  10K  [0603R]
R26  100K  [0603R]
SPI0  Header 6H  [PH06S]
TP1  TEST POINT  [HOLE53]  (value not drawn)
TP2  TEST POINT  [HOLE53]  (value not drawn)
TP3  TEST POINT  [HOLE53]  (value not drawn)
TP4  TEST POINT  [HOLE53]  (value not drawn)
U2  RTL8189ES  [RTL8189ES]
U3  SN65HVD230  [SOIC127P800-8N]
USBD1  usb device  [USB-MICRO-AB]
USBH1  Header 4  [PH04S_180]
USBH2  USB_A_VerticalType  [USB/A 90]

### Ports
CAN0Rx, CAN0Tx, DGND, I2C0_SCL, I2C0_SDA, PB[6..9], PD[0..7], U0_RXD, U0_TXD, U1_RXD, U1_TXD, U4_RXD, U4_TXD, U5_RXD, U5_TXD, U6_CTS, U6_RTS, U6_RXD, U6_TXD, U7_RXD, U7_TXD, U8_CTS, U8_RTS, U8_RXD, U8_TXD, U10_CTS, U10_RTS, U10_RXD, U10_TXD, USB0_DM, USB0_DP, USB0_ID, USB0_VBUS, USB1_DM, USB1_DP, VD33, VD50 (out)

### Nets
CHASSIS: FS3.2 USBD1.4(GND) USBD1.5(shell) USBD1.6(shell) USBH2.D1 USBH2.D2 USBH2.D3
DGND: ANT1.2 ANT1.3 C36.2 C38.2 C39.2 C40.2 C41.1 COM0.1 COM1.1 COM4.1 COM5.1 COM6.1 COM7.1 COM8.1 COM10.1 CT1.1 FS3.1 I2C0.1 J1.3 R9.1 R24.1 R25.1 R26.1 SPI0.1 TP1.1(TP) TP2.1(TP) TP3.1(TP) TP4.1(TP) U2.7(GND) U2.8(GND) U3.2(GND) USBH1.4 USBH2.4(GND) ; port DGND  [also labelled GND]
SDVD33: C36.1 CT1.2 Q1.D R11.1 R12.2 R13.2 R14.1 R15.2 R17.2 R20.2 U2.11(VDDIO) U2.12(3.3V)
USB_5V0: C40.1 C41.2 FS1.1 FS2.1 ; port VD50  [project net VD50]
USB_TO_DC: D1.1(K)
VD33: C37.1 COM0.4 COM1.4 COM4.4 COM5.4 COM6.6 COM7.4 COM8.6 COM10.6 I2C0.4 Q1.S R5.2 R6.2 SPI0.6 U3.3(VCC) ; port VD33  [project net IO_VD33]
CAN0H: CAN.2(1) R23.2 U3.7(CANH)
CAN0L: CAN.1(2) R23.1 U3.6(CANL)
CAN0Rs: R24.2 R25.2 R26.2 U3.8(Rs)
CAN0Rx: U3.4(R) ; port CAN0Rx
CAN0Tx: U3.1(D) ; port CAN0Tx
I2C0_SCL: I2C0.2 ; port I2C0_SCL
I2C0_SDA: I2C0.3 ; port I2C0_SDA
PB6: SPI0.2  [also labelled SPI0_CS]
PB7: SPI0.3  [also labelled SPI0_CLK]
PB8: SPI0.4  [also labelled SPI0_MOSI]
PB9: SPI0.5  [also labelled SPI0_MISO]
PD0: R20.1 U2.1(CMD)  [also labelled SDCmd]
PD1: U2.6(CLK)  [also labelled SDCLK]
PD2: R12.1 U2.5(DATA0)  [also labelled SDD0]
PD3: R13.1 U2.4(DATA1)  [also labelled SDD1]
PD4: R15.1 U2.3(DATA2)  [also labelled SDD2]
PD5: R17.1 U2.2(DATA3)  [also labelled SDD3]
PD6: PD6.1  [also labelled SDCd]
PD7: R8.2  [also labelled SDPwr]
PH0: R9.2 R10.2 ; port USB0_VBUS
U0_RXD: COM0.2 ; port U0_RXD  [project net PE1]
U0_TXD: COM0.3 ; port U0_TXD  [project net PE0]
U1_RXD: COM1.2 ; port U1_RXD
U1_TXD: COM1.3 ; port U1_TXD
U4_RXD: COM4.2 ; port U4_RXD
U4_TXD: COM4.3 ; port U4_TXD
U5_RXD: COM5.2 ; port U5_RXD  [project net PB1]
U5_TXD: COM5.3 ; port U5_TXD  [project net PB0]
U6_CTS: COM6.3 ; port U6_CTS  [project net PB5]
U6_RTS: COM6.2 ; port U6_RTS  [project net PB4]
U6_RXD: COM6.5 ; port U6_RXD  [project net PB3]
U6_TXD: COM6.4 ; port U6_TXD  [project net PB2]
U7_RXD: COM7.2 ; port U7_RXD
U7_TXD: COM7.3 ; port U7_TXD
U8_CTS: COM8.3 ; port U8_CTS
U8_RTS: COM8.2 ; port U8_RTS
U8_RXD: COM8.5 ; port U8_RXD
U8_TXD: COM8.4 ; port U8_TXD
U10_CTS: COM10.3 ; port U10_CTS  [project net PB15]
U10_RTS: COM10.2 ; port U10_RTS  [project net PB14]
U10_RXD: COM10.5 ; port U10_RXD  [project net PB13]
U10_TXD: COM10.4 ; port U10_TXD  [project net PB12]
USB0_DM: R19.2 ; port USB0_DM
USB0_DP: R16.2 ; port USB0_DP
USB0_ID: J1.2 ; port USB0_ID
USB0DM: R19.1 USBD1.2(D-) USBH1.2
USB0DP: R16.1 USBD1.3(D+) USBH1.3
USB1_DM: R21.2 ; port USB1_DM
USB1_DP: R22.2 ; port USB1_DP
NetANT1_1: ANT1.1 C39.1 R18.1
NetC37_2: C37.2 Q1.G R5.1 R8.1
NetC38_1: C38.1 R18.2 U2.9(ANT)
NetD1_2: D1.2(A) R10.1 USBD1.1(VBUS)
NetFS1_2: FS1.2 USBH1.1
NetFS2_2: FS2.2 USBH2.1(Vbus)
NetJ1_1: J1.1 R6.1
NetR11_2: R11.2 U2.13(CS)
NetR14_2: R14.2 U2.10(WAKE)
NetR21_1: R21.1 USBH2.2(D-)
NetR22_1: R22.1 USBH2.3(D+)

Not connected (* = marked no-connect by the designer): U3 5(Vref)

### Buses and harness runs
bus PB[6..9] = port PB[6..9]
bus PD[0..7] = port PD[0..7]

### Notes on the sheet
- SDIO WIFI
- USB0 DEVICE
- (near J1) Device
- (near J1) HOST
- USB0 HOST
- (near I2C0) I2C
- USB1 HOST
- UART
- (near U3) CAN bus0
- SPI
- (near CAN) CANH
- (near CAN) CANL
- CAN Slope

### Library data of the parts
C36-C39 = C/SMD0603
C40 C41 = C/SMD1206
CAN = CON2: Connector
COM0 COM1 COM4 COM5 COM7 I2C0 USBH1 = Header 4: Header, 4-Pin; LatestRevisionDate: 17-Jul-2002; LatestRevisionNote: Re-released for DXP Platform.; Publisher: Altium Limited
COM6 COM8 COM10 SPI0 = Header 6H: Header, 6-Pin, Right Angle; LatestRevisionDate: 17-Jul-2002; LatestRevisionNote: Re-released for DXP Platform.; Publisher: Altium Limited
CT1 = CAP NP_Dup1
D1 = Diode 10TQ035: as D3 on sheet power; Published: 8-Jun-2000; LatestRevisionDate: 17-Jul-2002; LatestRevisionNote: Re-released for DXP Platform.; DatasheetVersion: PD-2.057B; PackageVersion: Feb-1998; PackageReference: TO-220AC; Publisher: Altium Limited; PackageDescription: TO, Thru-Hole, Vertical, Heatsink Mounted; 3 In-Line Leads (1 Absent); Pitch 2.54 mm; ComponentLink1Description: Manufacturer Link; ComponentLink1URL: http://www.irf.com/; ComponentLink2Description: Datasheet; ComponentLink2URL: http://www.irf.com/product-info/datasheets/data/10tq.pdf
FS1 FS2 R23 = Res1: Resistor; Published: *; Revision: *; Publisher: *; Value: *
FS3 = Inductor: Value: 100uH; Published: 8-Jun-2000; Revision: July-2002: Re-released for DXP Platform.; Publisher: Altium Limited
J1 = CON3
R5 R6 R8 R11-R15 R17 R18 R20 R24-R26 = R_Dup1
  R24-R26: Package: R0402
R9 R10 = res1: Resistor; Value: 1K; Published: 8-Jun-2000; Revision: July-2002: Re-released for DXP Platform.; Publisher: Altium Limited
R16 R19 R21 R22 = R/SMD0603_Dup1
TP1-TP4 = TEST POINT_Dup1
USBD1 = USB: USB接口
U3 = SN65HVD230: Package: SO-8

## Sheet configure.SchDoc
size A4
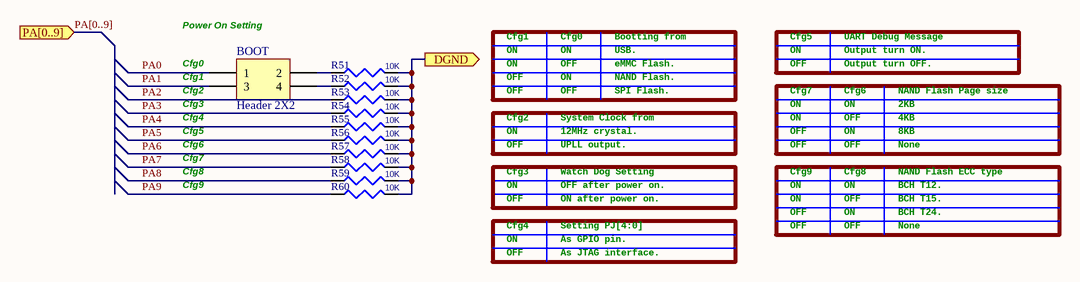
[diagram p5: configure.SchDoc]

### Parts
BOOT  Header 2X2  [HDR2X2]
R51  10K  [0603R]
R52  10K  [0603R]
R53  10K  [0603R]
R54  10K  [0603R]
R55  10K  [0603R]
R56  10K  [0603R]
R57  10K  [0603R]
R58  10K  [0603R]
R59  10K  [0603R]
R60  10K  [0603R]

### Ports
DGND (out), PA[0..9] (in)

### Nets
DGND: R51.2 R52.2 R53.2 R54.2 R55.2 R56.2 R57.2 R58.2 R59.2 R60.2 ; port DGND
PA0: BOOT.1
PA1: BOOT.3
PA2: R53.1
PA3: R54.1
PA4: R55.1
PA5: R56.1
PA6: R57.1
PA7: R58.1
PA8: R59.1
PA9: R60.1
NetBOOT_2: BOOT.2 R51.1
NetBOOT_4: BOOT.4 R52.1

### Buses and harness runs
bus PA[0..9] = port PA[0..9]

### Notes on the sheet
- (near BOOT) Power On Setting
- (near BOOT) Cfg0
- Cfg1
- ON
- Cfg0
- OFF
- USB.
- Bootting from
- eMMC Flash.
- Cfg5
- UART Debug Message
- Output turn ON.
- Output turn OFF.
- (near BOOT) Cfg1
- (near BOOT) Cfg2
- (near BOOT) Cfg3
- (near BOOT) Cfg4
- (near BOOT) Cfg5
- Cfg2
- 12MHz crystal.
- System Clock from
- SPI Flash.
- NAND Flash.
- Cfg7
- Cfg6
- 2KB
- NAND Flash Page size
- 4KB
- 8KB
- Cfg8
- Cfg9
- Cfg3
- UPLL output.
- OFF after power on.
- Watch Dog Setting
- ON after power on.
- None
- BCH T12.
- NAND Flash ECC type
- BCH T15.
- Cfg4
- As GPIO pin.
- Setting PJ[4:0]
- As JTAG interface.
- BCH T24.

### Library data of the parts
BOOT = Header 2X2: Header, 2-Pin, Dual row; LatestRevisionDate: 17-Jul-2002; LatestRevisionNote: Re-released for DXP Platform.; Publisher: Altium Limited
R51-R60 = R_Dup1

## Sheet RMII.SchDoc
size A4
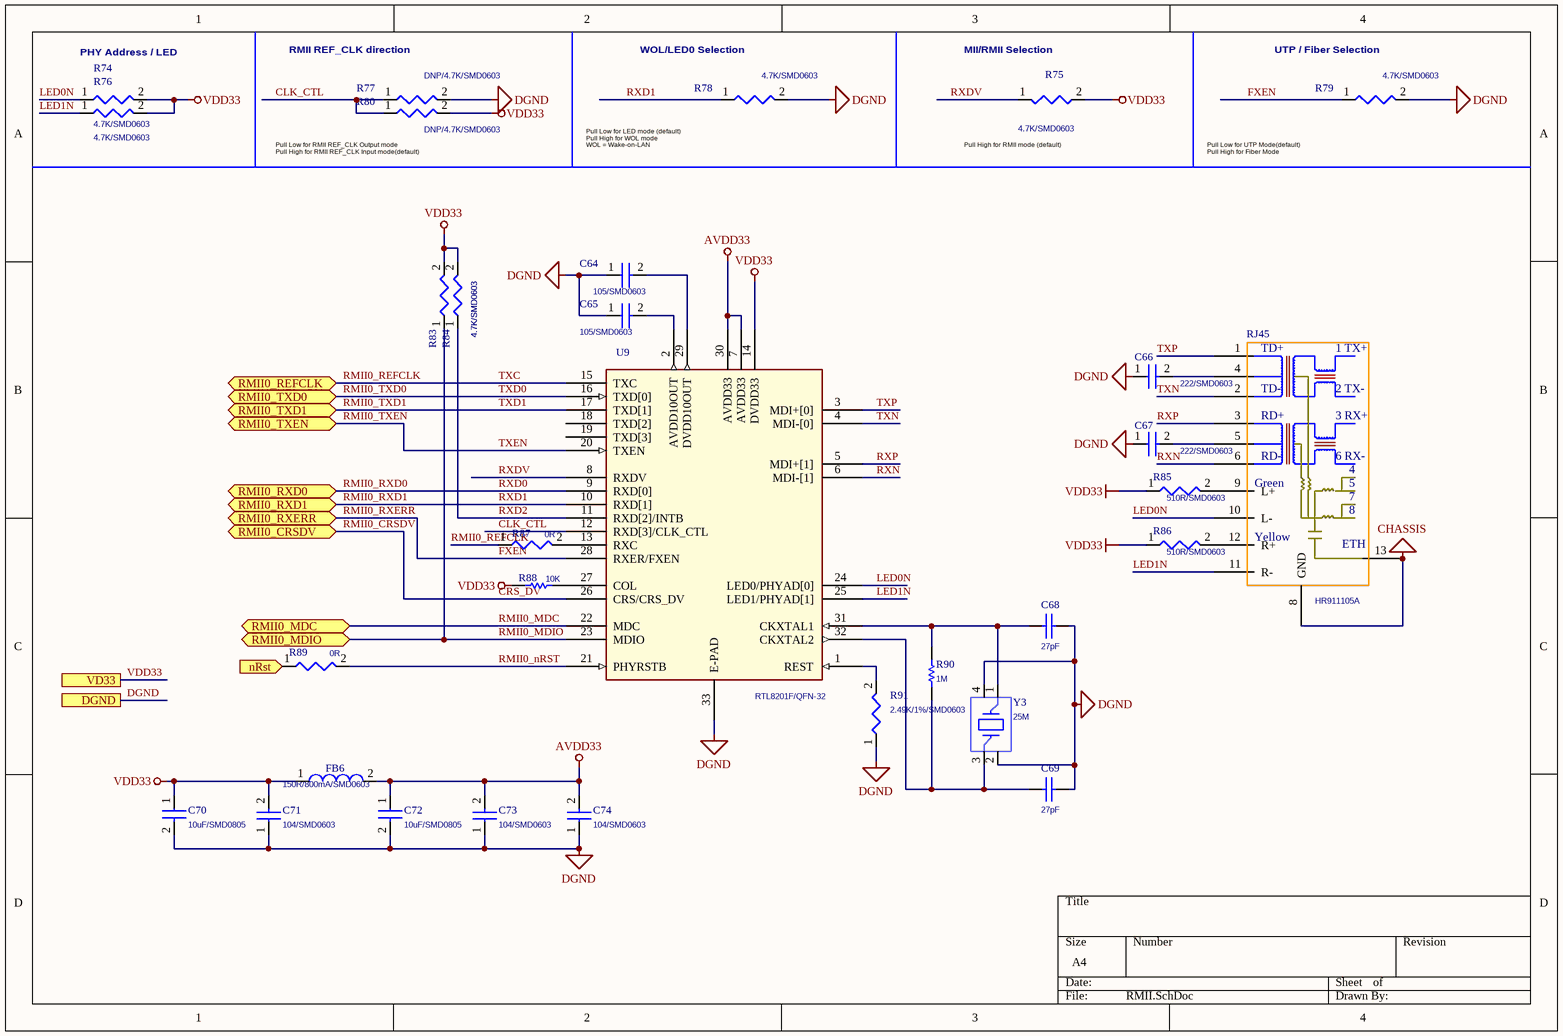
[diagram p6: RMII.SchDoc]

### Parts
C64  105/SMD0603  [0603C]
C65  105/SMD0603  [0603C]
C66  222/SMD0603  [0603C]
C67  222/SMD0603  [0603C]
C68  27pF  [0603C]
C69  27pF  [0603C]
C70  10uF/SMD0805  [C0805]
C71  104/SMD0603  [0603C]
C72  10uF/SMD0805  [C0805]
C73  104/SMD0603  [0603C]
C74  104/SMD0603  [0603C]
FB6  150R/800mA/SMD0603  [0603R]
R74  4.7K/SMD0603  [0603R]
R75  4.7K/SMD0603  [0603R]
R76  4.7K/SMD0603  [0603R]
R77  DNP/4.7K/SMD0603  [0603R]
R78  4.7K/SMD0603  [0603R]
R79  4.7K/SMD0603  [0603R]
R80  DNP/4.7K/SMD0603  [0603R]
R83  4.7K/SMD0603  [0603R]
R84  4.7K/SMD0603  [0603R]
R85  510R/SMD0603  [0603R]
R86  510R/SMD0603  [0603R]
R87  0R  [0603R]
R88  10K  [0603C]
R89  0R  [0603R]
R90  1M  [0603C]
R91  2.49K/1%/SMD0603  [0603R]
RJ45  HR911105A  [HR911105A]
U9  RTL8201F/QFN-32  [QFN32]
Y3  25M  [HCX-3SB3225]

### Ports
DGND, nRst (in), RMII0_CRSDV, RMII0_MDC, RMII0_MDIO, RMII0_REFCLK, RMII0_RXD0, RMII0_RXD1, RMII0_RXERR, RMII0_TXD0, RMII0_TXD1, RMII0_TXEN, VD33

### Nets
AVDD33: C72.1 C73.2 C74.2 FB6.2 U9.7(AVDD33) U9.30(AVDD33)
CHASSIS: RJ45.8(GND) RJ45.13
DGND: C64.1 C65.1 C66.1 C67.1 C68.2 C69.2 C70.2 C71.1 C72.2 C73.1 C74.1 R77.2 R78.2 R79.2 R91.1 U9.33(E-PAD) Y3.2 Y3.4 ; port DGND
VDD33: C70.1 C71.2 FB6.1 R74.2 R75.2 R76.2 R80.2 R83.2 R84.2 R85.1 R86.1 R88.2 U9.14(DVDD33) ; port VD33  [project net IO_VD33]
CLK_CTL: R77.1 R80.1 U9.12(RXD[3]/CLK_CTL)
CRS_DV: U9.26(CRS/CRS_DV) ; port RMII0_CRSDV  [also labelled RMII0_CRSDV]
FXEN: R79.1 U9.28(RXER/FXEN) ; port RMII0_RXERR  [also labelled RMII0_RXERR]
LED0N: R74.1 RJ45.10(L-) U9.24(LED0/PHYAD[0])
LED1N: R76.1 RJ45.11(R-) U9.25(LED1/PHYAD[1])
nRst: R89.1 ; port nRst
RMII0_MDC: U9.22(MDC) ; port RMII0_MDC  [project net PF0]
RMII0_MDIO: R83.1 U9.23(MDIO) ; port RMII0_MDIO  [project net PF1]
RMII0_nRST: R89.2 U9.21(PHYRSTB)
RMII0_REFCLK: R87.1 U9.15(TXC) ; port RMII0_REFCLK  [also labelled TXC]  [project net PF5]
RMII0_RXD0: U9.9(RXD[0]) ; port RMII0_RXD0  [also labelled RXD0]  [project net PF6]
RMII0_RXD1: R78.1 U9.10(RXD[1]) ; port RMII0_RXD1  [also labelled RXD1]  [project net PF7]
RMII0_TXD0: U9.16(TXD[0]) ; port RMII0_TXD0  [also labelled TXD0]  [project net PF2]
RMII0_TXD1: U9.17(TXD[1]) ; port RMII0_TXD1  [also labelled TXD1]  [project net PF3]
RMII0_TXEN: U9.20(TXEN) ; port RMII0_TXEN  [also labelled TXEN]  [project net PF4]
RXD2: R84.1 U9.11(RXD[2]/INTB)
RXDV: R75.1 U9.8(RXDV)
RXN: RJ45.6 U9.6(MDI-[1])
RXP: RJ45.3 U9.5(MDI+[1])
TXN: RJ45.2 U9.4(MDI-[0])
TXP: RJ45.1 U9.3(MDI+[0])
NetC64_2: C64.2 U9.29(DVDD10OUT)
NetC65_2: C65.2 U9.2(AVDD10OUT)
NetC66_2: C66.2 RJ45.4
NetC67_2: C67.2 RJ45.5
NetC68_1: C68.1 R90.2 U9.31(CKXTAL1) Y3.1
NetC69_1: C69.1 R90.1 U9.32(CKXTAL2) Y3.3
NetR85_2: R85.2 RJ45.9(L+)
NetR86_2: R86.2 RJ45.12(R+)
NetR87_2: R87.2 U9.13(RXC)
NetR88_1: R88.1 U9.27(COL)
NetR91_2: R91.2 U9.1(REST)

Not connected (* = marked no-connect by the designer): U9 18(TXD[2]) 19(TXD[3])

### Notes on the sheet
- PHY Address / LED
- RMII REF_CLK direction
- (near R78) WOL/LED0 Selection
- (near R75) MII/RMII Selection
- (near R79) UTP / Fiber Selection
- Pull Low for RMII REF_CLK Output mode
  Pull High for RMII REF_CLK Input mode(default)
- (near R78) Pull Low for LED mode (default)
  Pull High for WOL mode
  WOL = Wake-on-LAN
- (near R75) Pull High for RMII mode (default)
- (near R79) Pull Low for UTP Mode(default)
  Pull High for Fiber Mode
- (in symbol HR911105A) TD+; 1 TX+; TD-; 2 TX-; RD+; 3 RX+; RD-; 6 RX-; Green; 7; Yellow; ETH

### Library data of the parts
C64-C67 C71 C73 C74 = C/SMD0603
C68 C69 = CAP: Capacitor
C70 C72 = C/SMD0805
FB6 = FB/SMD0603
R74-R80 R83-R87 R89 R91 = R/SMD0603
R88 R90 = Res1: Resistor; Value: 1K; Published: 8-Jun-2000; Revision: July-2002: Re-released for DXP Platform.; Publisher: Altium Limited
Y3 = 12Mhz

## Nets that join several sheets
CHASSIS: interface (7 pins), RMII (RJ45.8 RJ45.13)
CORE_VD12: nuc977 (17 pins), power (5 pins)
DDR_VD18: nuc977 (9 pins), power (C57.1 C58.1 CK2.2 R46.2)
DGND: nuc977 (41 pins), power (38 pins), flash (8 pins), interface (33 pins), configure (10 pins), RMII (18 pins)
IO_VD33: nuc977 (20 pins), power (11 pins), flash (13 pins), interface (15 pins), RMII (13 pins)
RTC_VD33: nuc977 (C11.1 C12.2 U1.35), power (5 pins)
USB_TO_DC: power (DC.1 SW1.1), interface (D1.1)
VD50: power (12 pins), interface (C40.1 C41.2 FS1.1 FS2.1)
CAN0Rx: nuc977 (U1.69), interface (U3.4)
CAN0Tx: nuc977 (U1.70), interface (U3.1)
CRS_DV: nuc977 (U1.103), RMII (U9.26)
FXEN: nuc977 (U1.102), RMII (R79.1 U9.28)
I2C0_SCL: nuc977 (U1.3), interface (I2C0.2)
I2C0_SDA: nuc977 (U1.2), interface (I2C0.3)
NAND_ALE: nuc977 (U1.44), flash (U7.17)
NAND_CLE: nuc977 (U1.45), flash (U7.16)
NAND_D0: nuc977 (U1.49), flash (U7.29)
NAND_D1: nuc977 (R66.1 U1.50), flash (U7.30)
NAND_D2: nuc977 (R70.1 U1.51), flash (U7.31)
NAND_D3: nuc977 (U1.52), flash (U7.32)
NAND_D4: nuc977 (R71.1 U1.53), flash (U7.41)
NAND_D5: nuc977 (R72.1 U1.54), flash (U7.42)
NAND_D6: nuc977 (R73.1 U1.55), flash (U7.43)
NAND_D7: nuc977 (R81.1 U1.56), flash (U7.44)
NAND_nCS0: nuc977 (R61.1 U1.42), flash (U7.9)
NAND_nRE: nuc977 (R65.1 U1.47), flash (U7.8)
NAND_nWE: nuc977 (R63.1 U1.46), flash (U7.18)
NAND_nWP: nuc977 (R62.1 U1.43), flash (R64.2 U7.19)
NAND_RDY0: nuc977 (U1.48), flash (R50.2 U7.7)
nRst: nuc977 (U1.80), power (C45.2 Q7.C R38.2 RESET.2), RMII (R89.1)
PA0: nuc977 (GPIO.9 U1.34), configure (BOOT.1)
PA1: nuc977 (GPIO.10 U1.33), configure (BOOT.3)
PA2: nuc977 (GPIO.11 U1.32), configure (R53.1)
PA3: nuc977 (GPIO.12 U1.31), configure (R54.1)
PA4: nuc977 (GPIO.13 U1.30), configure (R55.1)
PA5: nuc977 (GPIO.14 U1.29), configure (R56.1)
PA6: nuc977 (GPIO.15 U1.28), configure (R57.1)
PA7: nuc977 (GPIO.16 U1.27), configure (R58.1)
PA8: nuc977 (GPIO.17 U1.26), configure (R59.1)
PA9: nuc977 (GPIO.18 U1.25), configure (R60.1)
PB0: nuc977 (U1.58), interface (COM5.3)
PB1: nuc977 (U1.59), interface (COM5.2)
PB2: nuc977 (U1.60), interface (COM6.4)
PB3: nuc977 (U1.61), interface (COM6.5)
PB4: nuc977 (U1.62), interface (COM6.2)
PB5: nuc977 (U1.63), interface (COM6.3)
PB6: nuc977 (U1.65), flash (R68.1 U8.1), interface (SPI0.2)
PB7: nuc977 (U1.66), flash (U8.6), interface (SPI0.3)
PB8: nuc977 (U1.67), flash (U8.5), interface (SPI0.4)
PB9: nuc977 (U1.68), flash (U8.2), interface (SPI0.5)
PB12: nuc977 (U1.71), interface (COM10.4)
PB13: nuc977 (U1.72), interface (COM10.5)
PB14: nuc977 (U1.73), interface (COM10.2)
PB15: nuc977 (U1.74), interface (COM10.3)
PD0: nuc977 (U1.86), interface (R20.1 U2.1)
PD1: nuc977 (U1.87), interface (U2.6)
PD2: nuc977 (U1.88), interface (R12.1 U2.5)
PD3: nuc977 (U1.89), interface (R13.1 U2.4)
PD4: nuc977 (U1.90), interface (R15.1 U2.3)
PD5: nuc977 (U1.91), interface (R17.1 U2.2)
PD6: nuc977 (U1.92), interface (PD6.1)
PD7: nuc977 (U1.93), interface (R8.2)
PE0: nuc977 (U1.97), interface (COM0.3)
PE1: nuc977 (U1.96), interface (COM0.2)
PF0: nuc977 (U1.111), RMII (U9.22)
PF1: nuc977 (U1.110), RMII (R83.1 U9.23)
PF2: nuc977 (U1.109), RMII (U9.16)
PF3: nuc977 (U1.108), RMII (U9.17)
PF4: nuc977 (U1.107), RMII (U9.20)
PF5: nuc977 (U1.106), RMII (R87.1 U9.15)
PF6: nuc977 (U1.105), RMII (U9.9)
PF7: nuc977 (U1.104), RMII (R78.1 U9.10)
PH0: nuc977 (U1.113), interface (R9.2 R10.2)
SysPwrEn: nuc977 (U1.36), power (D2.1)
SysWkUp: nuc977 (U1.37), power (Q5.D R30.2 R35.1 RTC_KEY.2)
U1_RXD: nuc977 (R65.2), interface (COM1.2)
U1_TXD: nuc977 (R63.2), interface (COM1.3)
U4_RXD: nuc977 (R70.2), interface (COM4.2)
U4_TXD: nuc977 (R66.2), interface (COM4.3)
U7_RXD: nuc977 (R62.2), interface (COM7.2)
U7_TXD: nuc977 (R61.2), interface (COM7.3)
U8_CTS: nuc977 (R81.2), interface (COM8.3)
U8_RTS: nuc977 (R73.2), interface (COM8.2)
U8_RXD: nuc977 (R72.2), interface (COM8.5)
U8_TXD: nuc977 (R71.2), interface (COM8.4)
USB0_DM: nuc977 (U1.124), interface (R19.2)
USB0_DP: nuc977 (U1.125), interface (R16.2)
USB0_ID: nuc977 (U1.1), interface (J1.2)
USB1_DM: nuc977 (U1.118), interface (R21.2)
USB1_DP: nuc977 (U1.119), interface (R22.2)